# EasyEDA Pro project ProPrj_AUCompetition.epro, board 主控
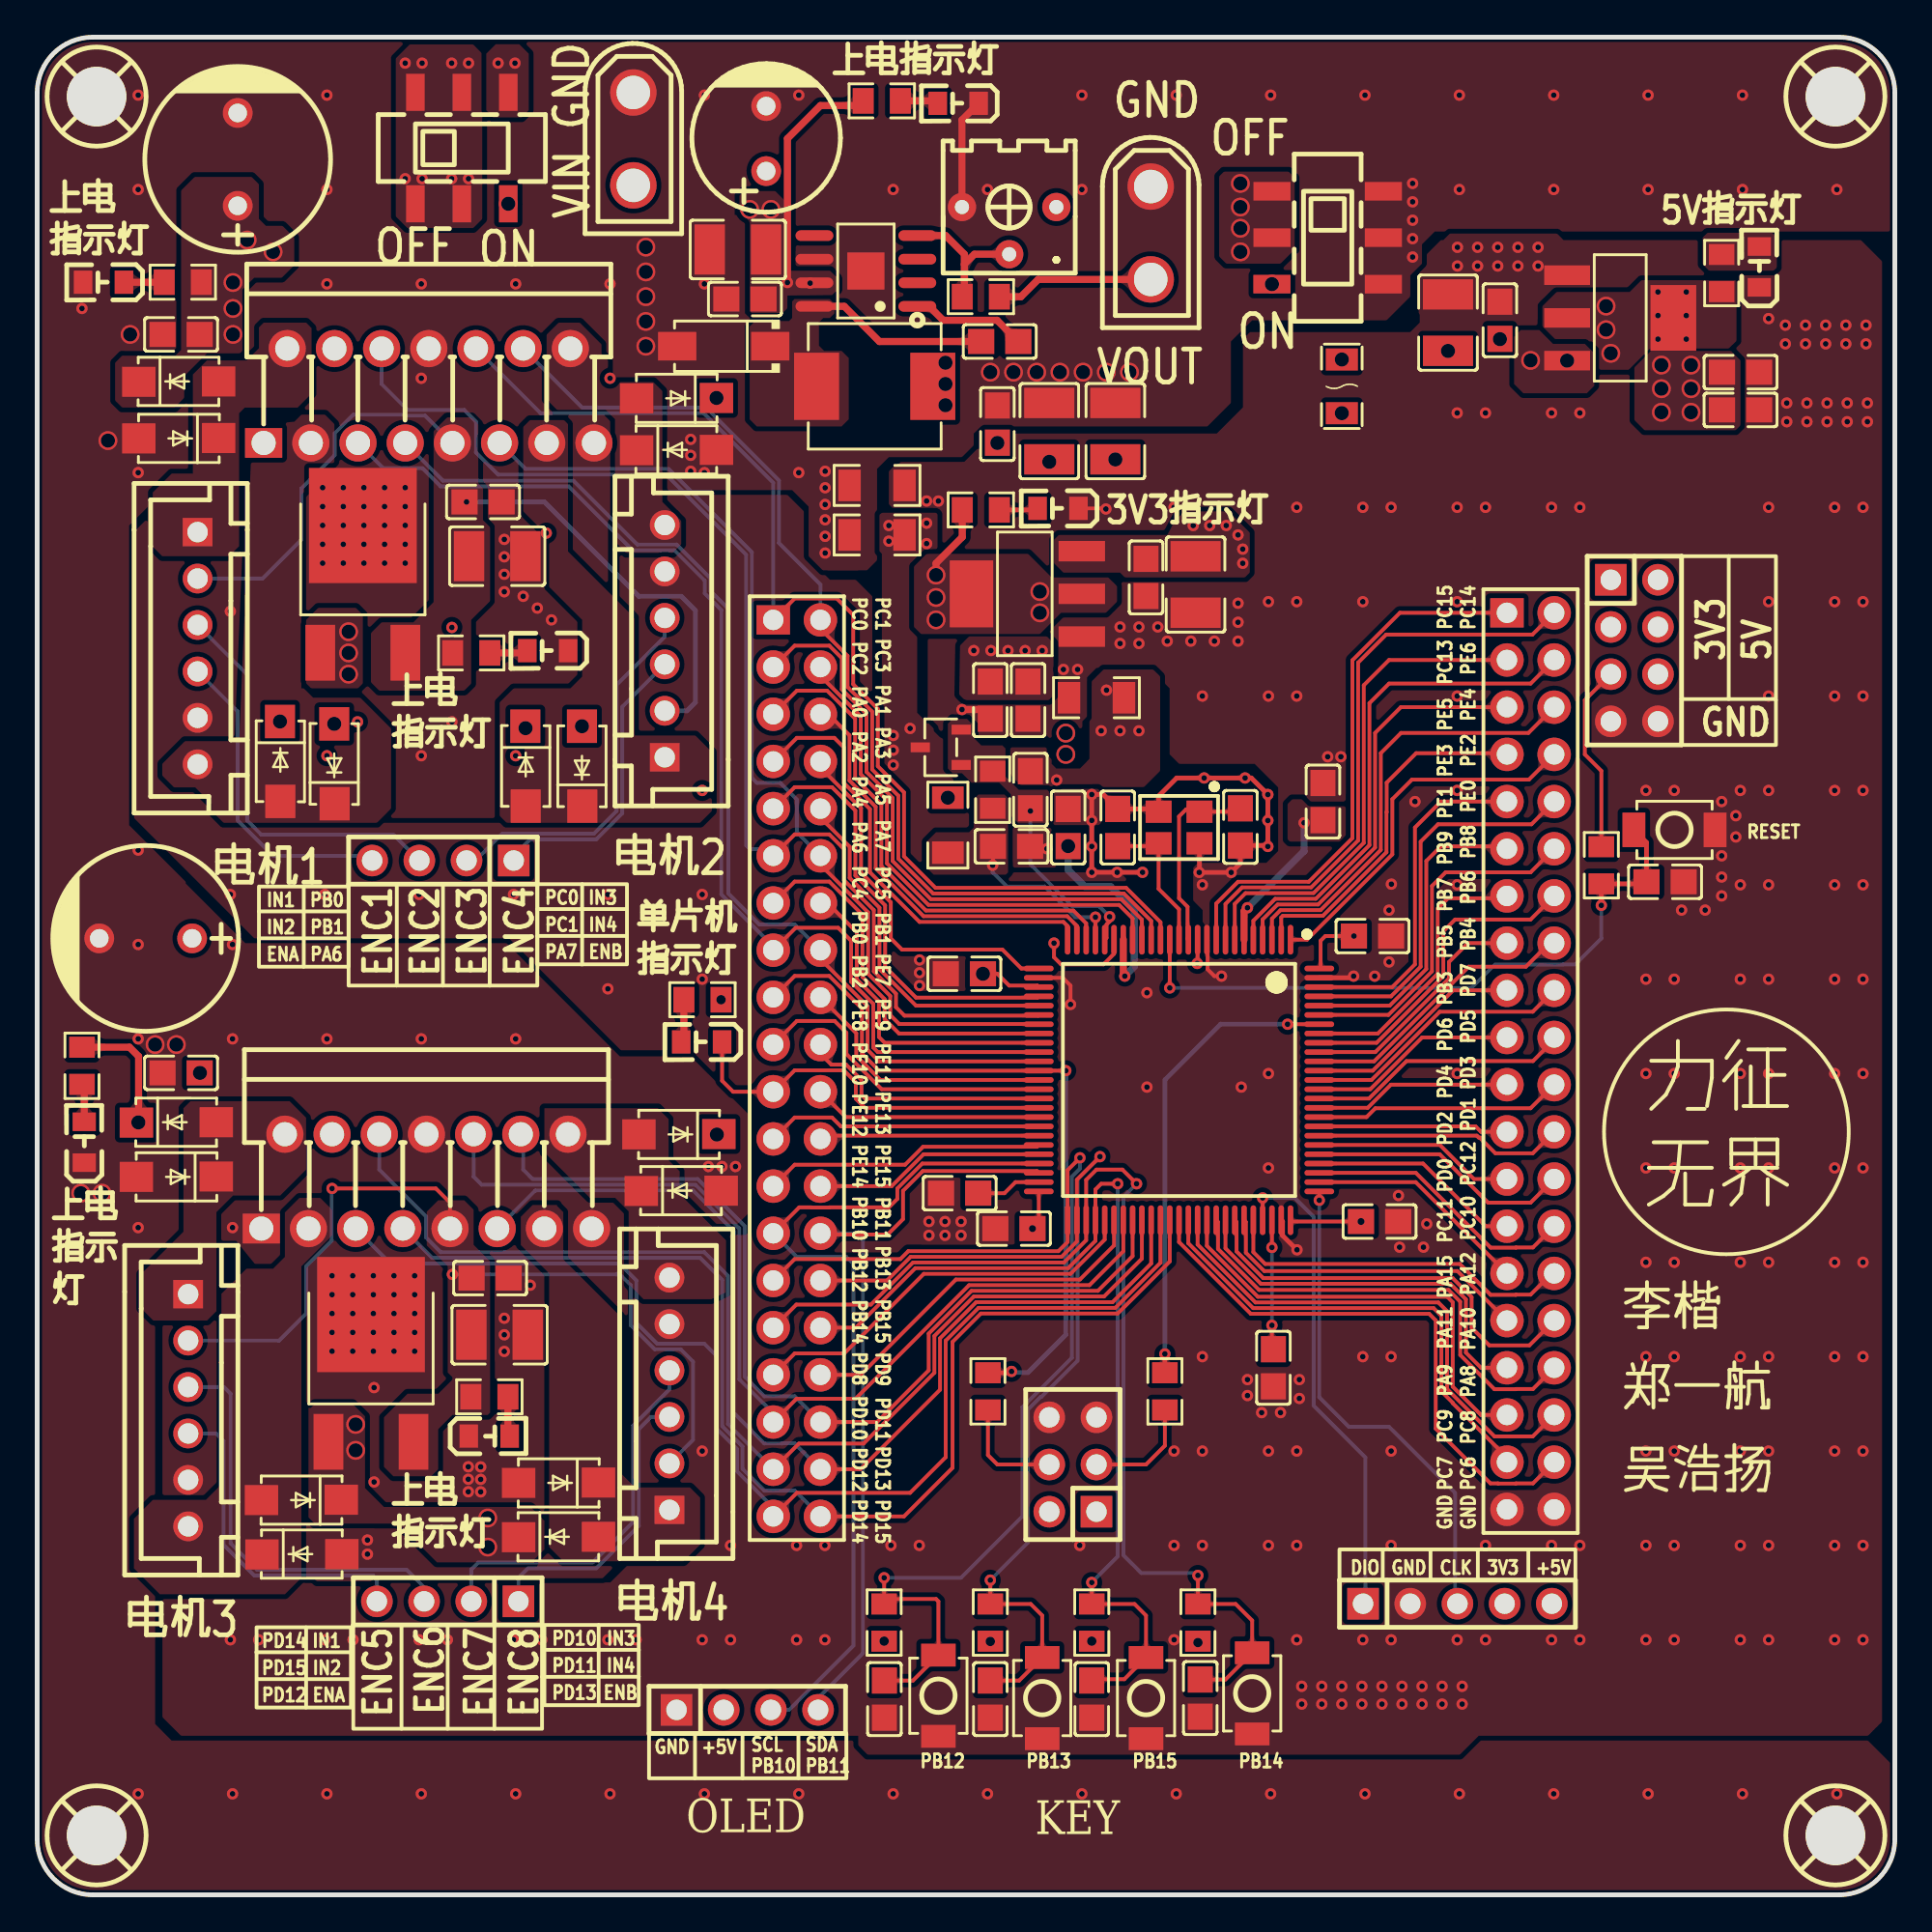
[diagram p7: board, top side]
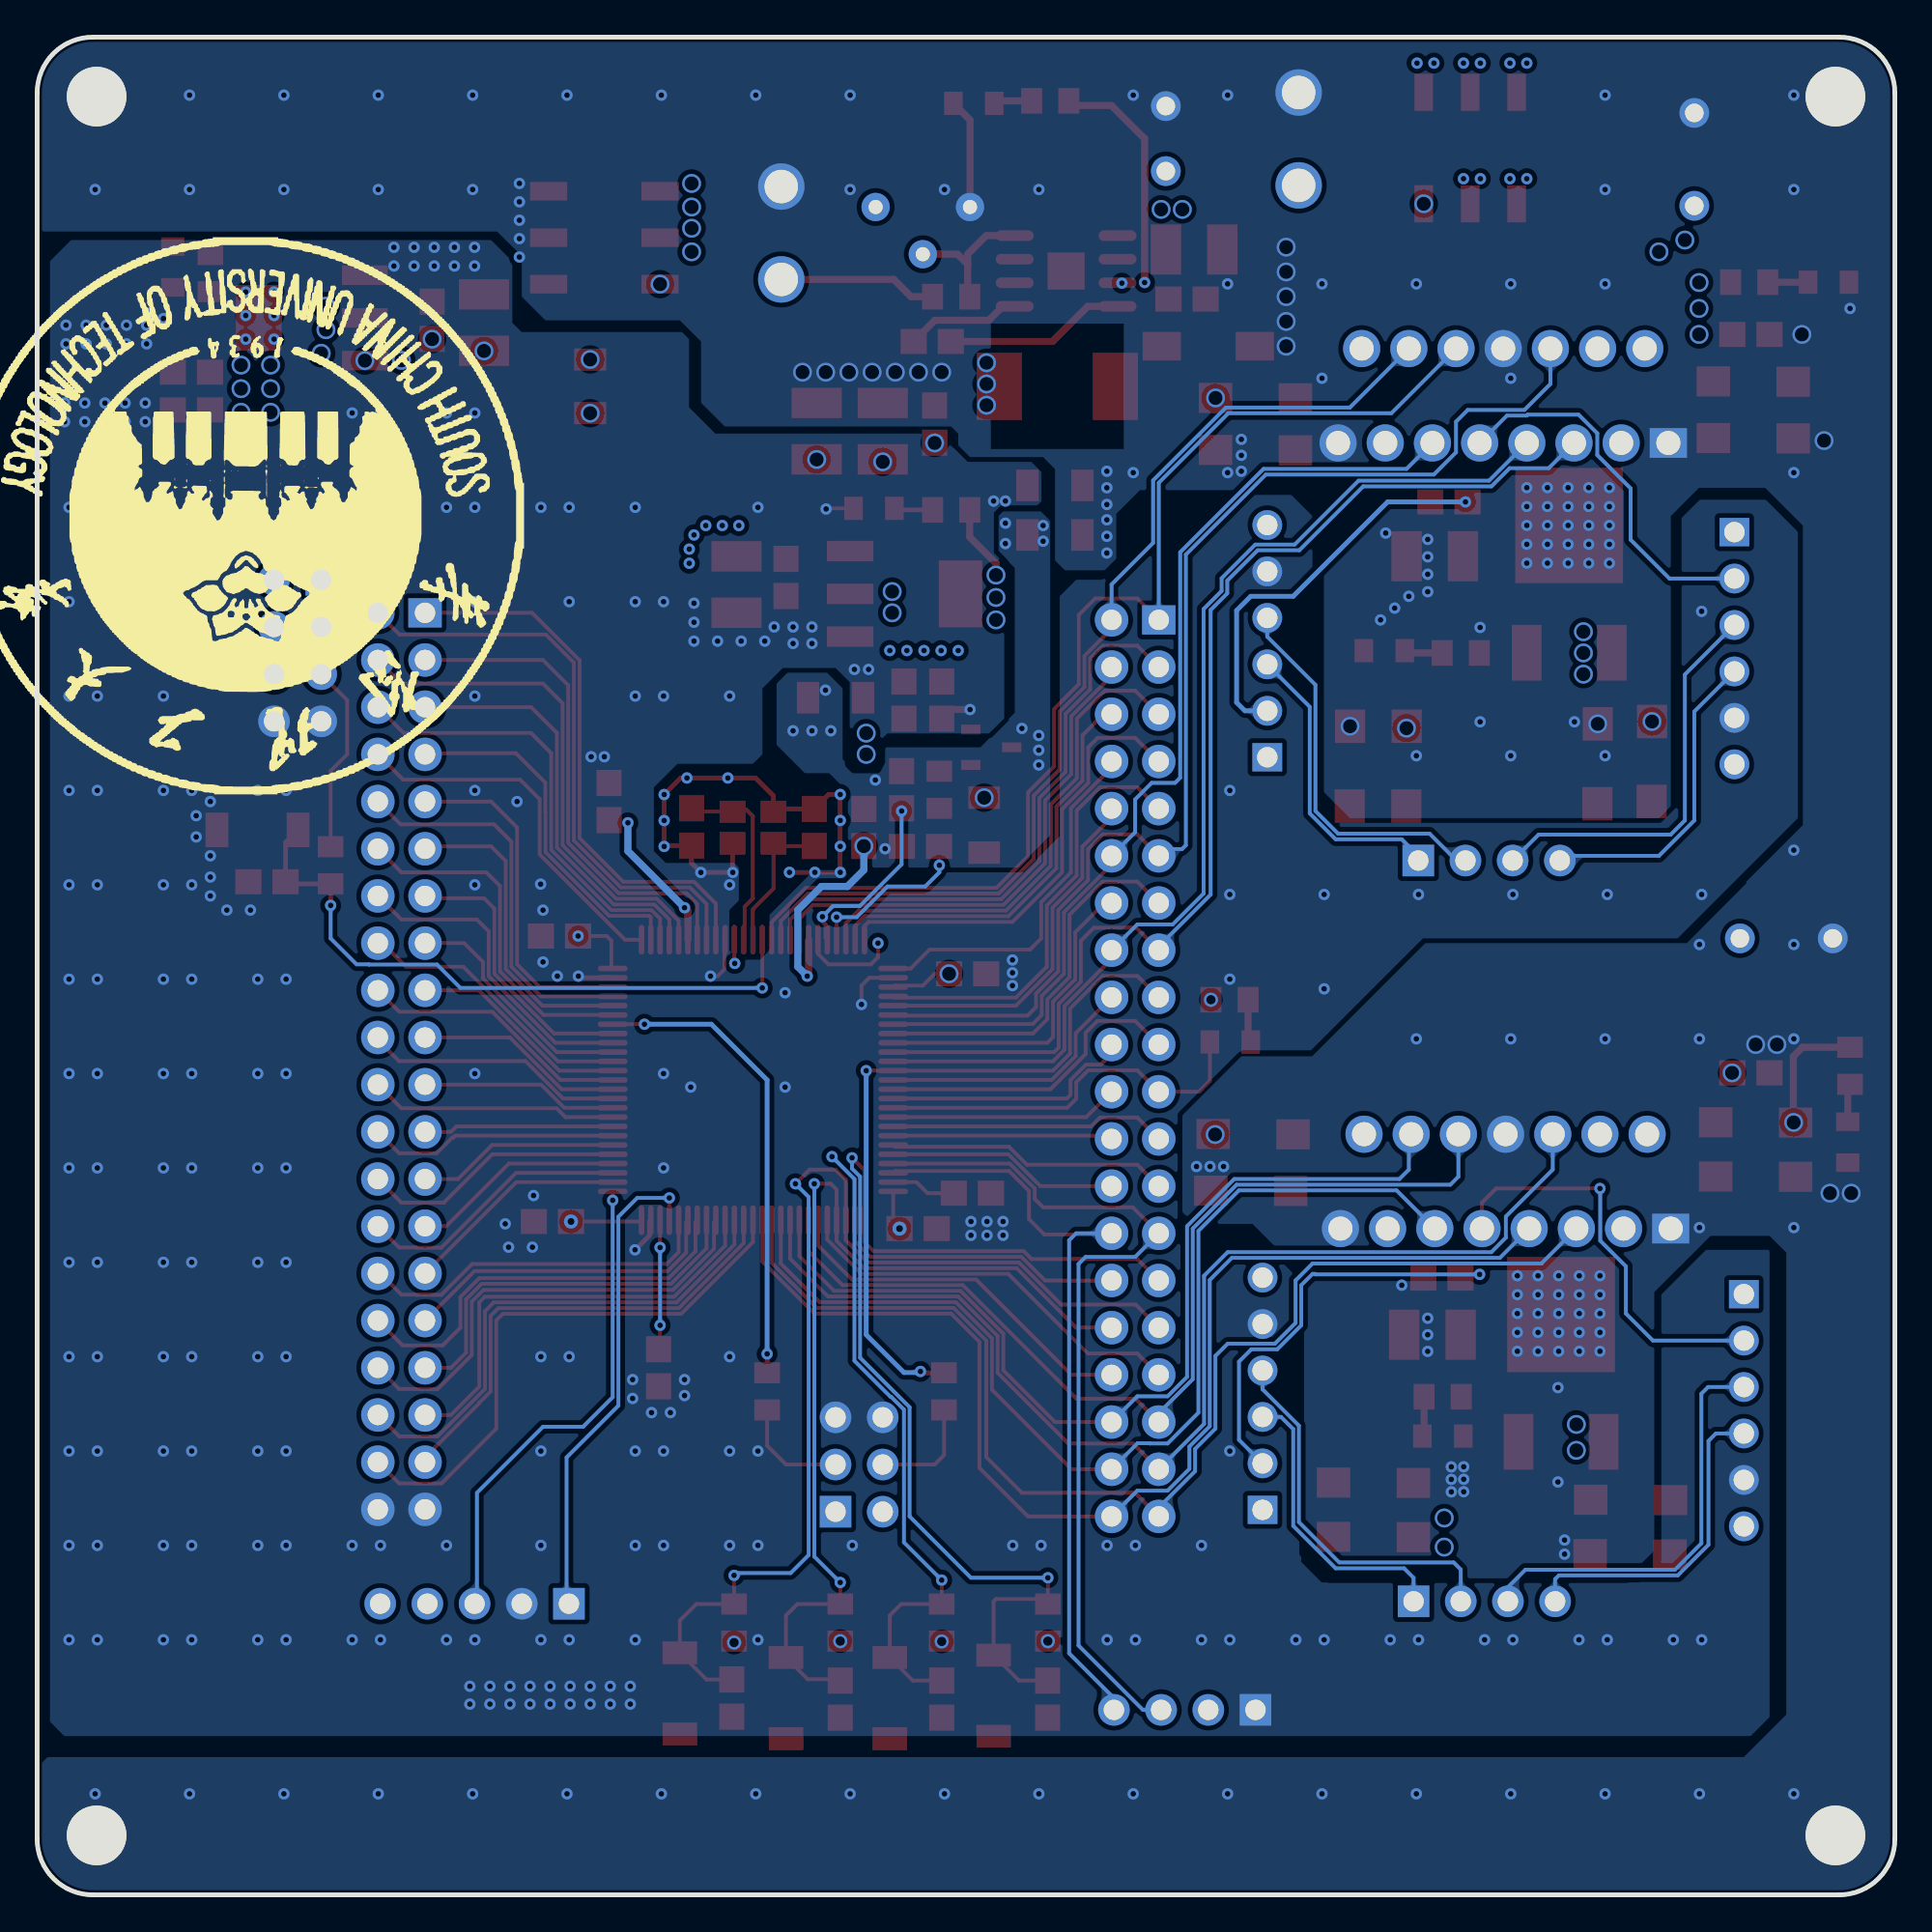
[diagram p8: board, bottom side, seen from below]

Outline 100 x 100 mm; copper layers: Top Layer, GND, POWER, Bottom Layer. Coordinates in mm from the lower left corner of the outline.
Outline path: 0,97 0,3 arc(0.88,0.88) 3,0 97,0 arc(99.12,0.88) 100,3 100,97 arc(99.12,99.12) 97,100 3,100 arc(0.88,99.12) 0,97
Stack: Top Layer 0.035mm Outer layer thickness 1oz / Dielectric1 0.2104mm 7628 RC49% 8.6mil / GND 0.0152mm Inner layer thickness / Dielectric2 1.065mm 1.1mm H/HOZ Copper / POWER 0.0152mm Inner layer thickness / Dielectric3 0.2104mm 7628 RC49% 8.6mil / Bottom Layer 0.035mm Outer layer thickness 1oz

## Design rules (mm)
spacing copperThickness1oz (default): track to track 0.102, other pairs 0.152 to 0.3
spacing copperThickness2oz: track to track 0.203, other pairs 0.152 to 0.3
track width copperThickness1oz (default): min 0.127, default 0.203, max 2.54
track width copperThickness2oz: min 0.203, default 0.254, max 2.54
differential pair differentialPair (default): width min 0.127, default 0.203, max 2.54; gap min 0.152, default 0.152
net DGND uses copperRegion
net PGND uses copperRegion
net VIN uses copperRegion
net VOUT uses copperRegion
net DCDC_OUT uses copperRegion
net VCC+3.3V uses copperRegion
net VCC+5V uses copperRegion
net AGND uses copperRegion
net $2N98 uses copperRegion
net OUT1 uses copperRegion
net OUT2 uses copperRegion
net OUT3 uses copperRegion
net OUT4 uses copperRegion
net $1N28 uses copperRegion
net 1LOG+5V uses copperRegion
net MVIN uses copperRegion

## Placement (name value [footprint] x y rotation side)
C1  10nF  [C0805]  51.82 83.62 180 top
C2  47uF  [CAP-TH_BD8.0-P3.50-D0.6-FD]  39.24 94.54 90 top
C3  100nF  [C0805]  38.1 85.9 180 top
C5  22uF  [C1210]  37.72 88.57 180 top
C6  22uF  [C1210]  58.04 78.79 270 top
C7  100nF  [C0805]  51.69 79.17 90 top
C8  100nF  [C0805]  59.69 70.92 270 top
C9  22uF  [C1210]  62.36 70.54 90 top
C10  100nF  [C0805]  51.31 64.31 270 top
C11  100nF  [C0805]  53.34 64.31 270 top
C12  22uF  [C1210]  75.95 84.63 270 top
C13  100nF  [C0805]  78.74 84.76 90 top
C14  100nF  [C0805]  91.69 81.97 0 top
C15  100nF  [C0805]  91.69 79.93 0 top
C16  100nF  [C0805]  52.45 56.44 0 top
C17  100nF  [C0805]  55.5 57.45 90 top
C18  100nF  [C0805]  69.22 58.85 90 top
C19  100nF  [C0805]  72.26 36.25 0 top
C20  100nF  [C0805]  71.88 51.61 0 top
C21  100nF  [C0805]  49.91 49.58 180 top
C22  100nF  [C0805]  52.58 35.86 180 top
C24  10uF  [C0805]  53.47 59.49 270 top
C25  20pF  [C0805]  64.77 57.49 270 top
C26  20pF  [C0805]  58.17 57.45 270 top
C27  100nF  [C0805]  87.63 54.53 0 top
C28  100nF  [C0805]  45.61 10.54 270 top
C29  22uF  [C1210]  24.89 30.15 180 top
C30  22uF  [C1210]  24.77 72.06 180 top
C33  22uF  [C1210]  54.48 78.79 270 top
C34  2.2uF  [C0805]  66.55 28.37 90 top
C35  2.2uF  [C0805]  49.66 37.77 0 top
C36  100nF  [C0805]  7.75 84 180 top
C38  100nF  [C0805]  24 74.98 0 top
C39  470uF  [CAP-TH_BD10.0-P5.00-D0.6-FD-A]  5.84 51.49 180 top
C40  100nF  [C0805]  7.75 44.25 180 top
C42  100nF  [C0805]  24.38 33.2 0 top
C43  470uF  [CAP-TH_BD10.0-P5.00-D0.6-FD-A]  10.8 93.42 90 top
C44  100nF  [C0805]  51.31 10.54 270 top
C45  100nF  [C0805]  62.61 10.59 270 top
C46  100nF  [C0805]  56.77 10.54 270 top
CN1  XT30UPB-M  [CONN-TH_XT30UPB-M]  32.09 94.52 270 top
CN2  XT30UPB-M  [CONN-TH_XT30UPB-M]  59.94 89.46 270 top
D2  SS34  [SMA_L4.3-W2.6-LS5.0-FD]  7.62 81.46 180 top
D3  SS34  [SMA_L4.3-W2.6-LS5.0-FD]  13.08 61.01 90 top
D4  SS34  [SMA_L4.3-W2.6-LS5.0-FD]  26.29 60.76 90 top
D5  SS34  [SMA_L4.3-W2.6-LS5.0-FD]  34.42 80.57 0 top
D6  SS34  [SMA_L4.3-W2.6-LS5.0-FD]  7.62 78.41 0 top
D7  SS34  [SMA_L4.3-W2.6-LS5.0-FD]  16 60.88 270 top
D8  SS34  [SMA_L4.3-W2.6-LS5.0-FD]  29.34 60.76 270 top
D9  SS34  [SMA_L4.3-W2.6-LS5.0-FD]  34.42 77.78 180 top
D10  SS34  [SMA_L4.3-W2.6-LS5.0-FD]  7.49 41.58 180 top
D11  SS34  [SMA_L4.3-W2.6-LS5.0-FD]  14.22 21.26 0 top
D12  SS34  [SMA_L4.3-W2.6-LS5.0-FD]  28.07 19.26 180 top
D13  SS34  [SMA_L4.3-W2.6-LS5.0-FD]  34.54 40.94 0 top
D14  SS34  [SMA_L4.3-W2.6-LS5.0-FD]  7.49 38.66 0 top
D15  SS34  [SMA_L4.3-W2.6-LS5.0-FD]  14.25 18.33 180 top
D16  SS34  [SMA_L4.3-W2.6-LS5.0-FD]  28.07 22.19 0 top
D17  SS34  [SMA_L4.3-W2.6-LS5.0-FD]  34.67 37.9 180 top
D18  SS54  [SMA_L4.4-W2.8-LS5.4-R-RD]  36.96 83.36 180 top
H1  PZ254V-11-05P  [HDR-TH_5P-P2.54-V-M]  76.45 15.67 0 top
H2  2.54-1*4P母  [HDR-TH_4P-P2.54-V-F]  38.23 9.96 0 top
H3  PZ254V-11-04P  [HDR-TH_4P-P2.54-V-M]  22.1 15.8 180 top
H4  PZ254V-11-04P  [HDR-TH_4P-P2.54-V-M]  21.84 55.68 180 top
KEY1  TS-1088R-02026  [SW-SMD_L3.9-W3.0-P4.45]  48.51 10.72 270 top
KEY2  TS-1088R-02026  [SW-SMD_L3.9-W3.0-P4.45]  54.1 10.59 270 top
KEY3  TS-1088R-02026  [SW-SMD_L3.9-W3.0-P4.45]  65.41 10.85 270 top
KEY4  TS-1088R-02026  [SW-SMD_L3.9-W3.0-P4.45]  59.69 10.59 270 top
L1  15uH  [IND-SMD_L7.0-W6.6_FXL0630]  45.09 81.2 180 top
LED1  -  [LED_0805]  49.53 96.44 180 top
LED2  -  [LED_0805]  92.71 87.68 90 top
LED3  -  [LED_0805]  54.9 74.64 180 top
LED4  -  [LED_0805]  35.72 45.92 180 top
LED5  -  [LED_0805]  3.52 86.81 180 top
LED6  -  [LED_0805]  27.43 66.98 180 top
LED7  -  [LED_0805]  24.38 24.69 0 top
LED8  -  [LED_0805]  2.54 40.56 90 top
R1  10kΩ  [R0805]  45.47 96.57 180 top
R2  3kΩ  [R0805]  90.68 87.3 270 top
R3  1kΩ  [R0805]  50.8 74.55 180 top
R4  0Ω  [R1206]  49.02 57.58 270 top
R5  0Ω  [R1206]  57.02 64.44 0 top
R6  1kΩ  [R0805]  51.44 59.49 270 top
R7  10kΩ  [R0805]  84.2 55.42 90 top
R8  10kΩ  [R0805]  60.71 27.1 90 top
R9  10kΩ  [R0805]  51.18 27.1 270 top
R10  1kΩ  [R0805]  35.81 48.18 0 top
R11  3kΩ  [R0805]  45.59 14.66 270 top
R12  10kΩ  [R0805]  7.84 86.81 180 top
R13  10kΩ  [R0805]  2.41 44.63 270 top
R14  3kΩ  [R0805]  23.37 66.85 180 top
R15  0Ω  [R1206]  45.21 75.87 180 top
R16  0Ω  [R1206]  45.21 73.2 180 top
R17  3kΩ  [R0805]  51.31 14.66 270 top
R18  3kΩ  [R0805]  62.48 14.66 270 top
R19  3kΩ  [R0805]  56.77 14.66 270 top
R20  10kΩ  [R0805]  50.8 86.03 0 top
R21  10kΩ  [RES-ADJ-TH_3362P]  52.32 89.59 180 top
R22  3kΩ  [R0805]  24.34 26.81 180 top
RESET  TS-1088R-02026  [SW-SMD_L3.9-W3.0-P4.45]  88.14 57.33 0 top
SCREW1  -  [M3螺丝]  96.8 96.8 0 top
SCREW2  -  [M3螺丝]  3.2 96.8 0 top
SCREW3  -  [M3螺丝]  3.2 3.2 0 top
SCREW4  -  [M3螺丝]  96.8 3.2 0 top
U1  TPS5430DDAR  [SOIC-8_L5.0-W4.0-P1.27-LS6.0-BL-EP2.0]  44.61 87.41 90 top
U2  AMS1117-3.3  [SOT-223-3_L6.5-W3.4-P2.30-LS7.0-BR]  53.26 70.03 0 top
U3  AMS1117-5.0  [SOT-223_L6.5-W3.5-P2.30-LS7.0-BR]  85.22 84.89 180 top
U4  STM32F407VET6  [LQFP-100_L14.0-W14.0-P0.50-LS16.0-BL]  61.47 43.87 180 top
U5  TL431ACDBZR  [SOT-23-3_L3.0-W1.7-P0.95-LS2.9-BR]  48.64 61.77 0 top
U6  DS1021-2x3SF11-B  [HDR-TH_6P-P2.54-V-M-R2-C3-S2.54]  55.75 23.16 90 top
U7  2541WV-2x20P  [HDR-TH_40P-P2.54-V-M-R2-C20-S2.54]  80.39 44.88 270 top
U8  2541WV-2x20P  [HDR-TH_40P-P2.54-V-M-R2-C20-S2.54]  40.89 44.5 270 top
U9  PJ7805TE  [TO-252-2_L6.6-W6.1-P4.57-LS9.9-BR-CW]  17.53 70.29 270 top
U10  L298N  [MULTIWATT-15_L19.6-W5.0-P1.27-L]  21.08 80.7 0 top
U11  ZX-XH2.54-6PZZ  [CONN-TH_6P-P2.50_ZX-XH2.54-6PZZ]  8.64 67.11 90 top
U12  ZX-XH2.54-6PZZ  [CONN-TH_6P-P2.50_ZX-XH2.54-6PZZ]  33.78 67.49 270 top
U13  ZX-XH2.54-6PZZ  [CONN-TH_6P-P2.50_ZX-XH2.54-6PZZ]  8.13 26.09 90 top
U14  ZX-XH2.54-6PZZ  [CONN-TH_6P-P2.50_ZX-XH2.54-6PZZ]  34.04 26.97 270 top
U15  L298N  [MULTIWATT-15_L19.6-W5.0-P1.27-L]  20.95 38.41 0 top
U16  YSSP2AG00  [SW-SMD_YSSP2AG00]  69.47 89.2 270 top
U17  HX PZ2.54-2x4P ZZ  [HDR-TH_8P-P2.54-V-M-R2-C4-S2.54]  85.98 66.98 270 top
U18  JK-nSMD005/60V  [F1206]  70.23 81.2 270 top
U19  PJ7805TE  [TO-252-2_L6.6-W6.1-P4.57-LS9.9-BR-CW]  17.97 27.81 270 top
U20  YSSP2AG00  [SW-SMD_YSSP2AG00]  22.86 94.03 0 top
X1  8MHz  [CRYSTAL-SMD_4P-L3.2-W2.5-BL_SIT8008BI]  61.47 57.45 180 top

## Footprints (pads in the part's own frame, mm; a bottom-side part is the same pattern mirrored in y, then rotated)
C0805
  rect 1.41x1.35 smd: 1(-1,0) 2(1,0)
C1210
  rect 1.635x2.7 smd: 1(-1.518,0) 2(1.518,0)
CAP-TH_BD8.0-P3.50-D0.6-FD
  round 1.6 hole 1: 1(-1.75,0) 2(1.75,0)
CAP-TH_BD10.0-P5.00-D0.6-FD-A
  round 1.6 hole 1: 1(-2.5,0) 2(2.5,0)
CONN-TH_6P-P2.50_ZX-XH2.54-6PZZ
  rect 1.524x1.6 hole 1.1: 1(6.25,0)
  round 1.6 hole 1.1: 2(3.75,0) 3(1.25,0) 4(-1.25,0) 5(-3.75,0) 6(-6.25,0)
CONN-TH_XT30UPB-M
  round 2.499 hole 1.801: 1(-2.499,0) 2(2.499,0)
CRYSTAL-SMD_4P-L3.2-W2.5-BL_SIT8008BI
  rect 1.4x1.2 smd: 1(-1.1,-0.85) 2(1.1,-0.85) 3(1.1,0.85) 4(-1.1,0.85)
F1206
  rect 1.19x1.728 smd: 1(-1.445,0) 2(1.445,0)
HDR-TH_4P-P2.54-V-F
  rect 1.7x1.7 hole 1.1: 1(-3.81,0)
  round 1.7 hole 1.1: 2(-1.27,0) 3(1.27,0) 4(3.81,0)
HDR-TH_4P-P2.54-V-M
  rect 1.7x1.7 hole 1.1: 1(-3.81,0)
  round 1.7 hole 1.1: 2(-1.27,0) 3(1.27,0) 4(3.81,0)
HDR-TH_5P-P2.54-V-M
  rect 1.7x1.7 hole 1.1: 1(-5.08,0)
  round 1.7 hole 1.1: 2(-2.54,0) 3(0,0) 4(2.54,0) 5(5.08,0)
HDR-TH_6P-P2.54-V-M-R2-C3-S2.54
  rect 1.7x1.7 hole 1.1: 1(-2.54,-1.27)
  round 1.7 hole 1.1: 2(-2.54,1.27) 3(0,-1.27) 4(0,1.27) 5(2.54,-1.27) 6(2.54,1.27)
HDR-TH_8P-P2.54-V-M-R2-C4-S2.54
  rect 1.7x1.7 hole 1.1: 1(-3.81,-1.27)
  round 1.7 hole 1.1: 2(-3.81,1.27) 3(-1.27,-1.27) 4(-1.27,1.27) 5(1.27,-1.27) 6(1.27,1.27) 7(3.81,-1.27) 8(3.81,1.27)
HDR-TH_40P-P2.54-V-M-R2-C20-S2.54
  rect 1.575x1.8 hole 1.1: 1(-24.13,-1.27)
  round 1.8 hole 1.1: 2(-24.13,1.27) 3(-21.59,-1.27) 4(-21.59,1.27) 5(-19.05,-1.27) 6(-19.05,1.27) 7(-16.51,-1.27) 8(-16.51,1.27) 9(-13.97,-1.27) 10(-13.97,1.27) 11(-11.43,-1.27) 12(-11.43,1.27) 13(-8.89,-1.27) 14(-8.89,1.27) 15(-6.35,-1.27) 16(-6.35,1.27) 17(-3.81,-1.27) 18(-3.81,1.27) 19(-1.27,-1.27) 20(-1.27,1.27) 21(1.27,-1.27) 22(1.27,1.27) 23(3.81,-1.27) 24(3.81,1.27) 25(6.35,-1.27) 26(6.35,1.27) 27(8.89,-1.27) 28(8.89,1.27) 29(11.43,-1.27) 30(11.43,1.27) 31(13.97,-1.27) 32(13.97,1.27) 33(16.51,-1.27) 34(16.51,1.27) 35(19.05,-1.27) 36(19.05,1.27) 37(21.59,-1.27) 38(21.59,1.27) 39(24.13,-1.27) 40(24.13,1.27)
IND-SMD_L7.0-W6.6_FXL0630
  rect 2.424x3.62 smd: 1(3.128,0) 2(-3.128,0)
LED_0805
  rect 1x1.25 smd: 1(-1.15,0.005) 2(1.05,0.005)
LQFP-100_L14.0-W14.0-P0.50-LS16.0-BL
  oval 0.3x1.6 smd: 1(-6,-7.55) 2(-5.5,-7.55) 3(-5,-7.55) 4(-4.5,-7.55) 5(-4,-7.55) 6(-3.5,-7.55) 7(-3,-7.55) 8(-2.5,-7.55) 9(-2,-7.55) 10(-1.5,-7.55) 11(-1,-7.55) 12(-0.5,-7.55) 13(0,-7.55) 14(0.5,-7.55) 15(1,-7.55) 16(1.5,-7.55) 17(2,-7.55) 18(2.5,-7.55) 19(3,-7.55) 20(3.5,-7.55) 21(4,-7.55) 22(4.5,-7.55) 23(5,-7.55) 24(5.5,-7.55) 25(6,-7.55) 51(6,7.55) 52(5.5,7.55) 53(5,7.55) 54(4.5,7.55) 55(4,7.55) 56(3.5,7.55) 57(3,7.55) 58(2.5,7.55) 59(2,7.55) 60(1.5,7.55) 61(1,7.55) 62(0.5,7.55) 63(0,7.55) 64(-0.5,7.55) 65(-1,7.55) 66(-1.5,7.55) 67(-2,7.55) 68(-2.5,7.55) 69(-3,7.55) 70(-3.5,7.55) 71(-4,7.55) 72(-4.5,7.55) 73(-5,7.55) 74(-5.5,7.55) 75(-6,7.55)
  oval 1.6x0.3 smd: 26(7.55,-6) 27(7.55,-5.5) 28(7.55,-5) 29(7.55,-4.5) 30(7.55,-4) 31(7.55,-3.5) 32(7.55,-3) 33(7.55,-2.5) 34(7.55,-2) 35(7.55,-1.5) 36(7.55,-1) 37(7.55,-0.5) 38(7.55,0) 39(7.55,0.5) 40(7.55,1) 41(7.55,1.5) 42(7.55,2) 43(7.55,2.5) 44(7.55,3) 45(7.55,3.5) 46(7.55,4) 47(7.55,4.5) 48(7.55,5) 49(7.55,5.5) 50(7.55,6) 76(-7.55,6) 77(-7.55,5.5) 78(-7.55,5) 79(-7.55,4.5) 80(-7.55,4) 81(-7.55,3.5) 82(-7.55,3) 83(-7.55,2.5) 84(-7.55,2) 85(-7.55,1.5) 86(-7.55,1) 87(-7.55,0.5) 88(-7.55,0) 89(-7.55,-0.5) 90(-7.55,-1) 91(-7.55,-1.5) 92(-7.55,-2) 93(-7.55,-2.5) 94(-7.55,-3) 95(-7.55,-3.5) 96(-7.55,-4) 97(-7.55,-4.5) 98(-7.55,-5) 99(-7.55,-5.5) 100(-7.55,-6)
M3螺丝
  round 3.2 hole 3.2: 1(0,0)
MULTIWATT-15_L19.6-W5.0-P1.27-L
  rect 2x1.6 hole 1.3: 1(-8.89,-2.54)
  round 2 hole 1.3: 2(-7.62,2.54) 3(-6.35,-2.54) 4(-5.08,2.54) 5(-3.81,-2.54) 6(-2.54,2.54) 7(-1.27,-2.54) 8(0,2.54) 9(1.27,-2.54) 10(2.54,2.54) 11(3.81,-2.54) 12(5.08,2.54) 13(6.35,-2.54) 14(7.62,2.54) 15(8.89,-2.54)
R0805
  rect 1.133x1.377 smd: 1(-1,0) 2(1,0)
R1206
  rect 1.208x1.701 smd: 1(-1.479,0) 2(1.479,0)
RES-ADJ-TH_3362P
  round 1.524 hole 0.762: 1(-2.54,-1.27) 2(0,1.27) 3(2.54,-1.27)
SMA_L4.3-W2.6-LS5.0-FD
  rect 1.8x1.62 smd: 1(-2.15,-0.009) 2(2.15,0.009)
SMA_L4.4-W2.8-LS5.4-R-RD
  rect 2.062x1.539 smd: 1(2.503,0) 2(-2.503,0)
SOIC-8_L5.0-W4.0-P1.27-LS6.0-BL-EP2.0
  oval 0.574x2.037 smd: 1(-1.905,-2.768) 2(-0.635,-2.768) 3(0.635,-2.768) 4(1.905,-2.768) 5(1.905,2.768) 6(0.635,2.768) 7(-0.635,2.768) 8(-1.905,2.768)
  rect 1.999x1.999 smd: 9(0,0)
SOT-23-3_L3.0-W1.7-P0.95-LS2.9-BR
  rect 1.038x0.532 smd: 1(1.101,-0.95) 2(1.101,0.95) 3(-1.101,0)
SOT-223-3_L6.5-W3.4-P2.30-LS7.0-BR
  rect 2.5x1.1 smd: 1(2.97,-2.3) 2(2.97,0) 3(2.97,2.3)
  rect 2.34x3.6 smd: 4(-2.97,0)
SOT-223_L6.5-W3.5-P2.30-LS7.0-BR
  rect 2.465x1.05 smd: 1(2.857,-2.3) 2(2.857,0) 3(2.857,2.3)
  rect 2.465x3.54 smd: 4(-2.857,0)
SW-SMD_L3.9-W3.0-P4.45
  rect 1.23x1.86 smd: 1(-2.185,0) 2(2.185,0)
SW-SMD_YSSP2AG00
  rect 1x2 smd: 1(-2.5,3) 2(0,3) 3(2.5,3) 4(-2.5,-3) 5(0,-3) 6(2.5,-3)
TO-252-2_L6.6-W6.1-P4.57-LS9.9-BR-CW
  rect 3x1.6 smd: 1(3.424,-2.29) 3(3.424,2.29)
  rect 6.2x5.8 smd: 2(-3.424,0)

## Nets
As in the schematic, except:
PGND: C2.2 C3.2 C5.2 C6.1 C7.2 C29.1 C30.1 C33.1 C36.2 C38.2 C39.2 C40.2 C42.2 C43.2 CN1.1 CN2.1 D6.1 D7.1 D8.1 D9.1 D14.1 D15.1 D16.1 D17.1 D18.1 LED1.1 LED5.2 LED6.1 LED7.1 LED8.1 R15.2 R16.2 R21.3 SCREW1.1 SCREW2.1 SCREW3.1 SCREW4.1 U1.6 U1.9 U9.2 U10.1 U10.8 U10.15 U15.1 U15.8 U15.15 U16.1 U16.2 U16.3 U19.2
$3N201: LED5.1 R12.2

Pads without a net: R21 1; U1 2 3 5

## Via types
v1: diameter 0.61, hole 0.305, Top Layer to Bottom Layer, 499 vias
v2: diameter 1.016, hole 0.762, Top Layer to Bottom Layer, 77 vias
v3: diameter 0.762, hole 0.508, Top Layer to Bottom Layer, 5 vias
v4: diameter 0.762, hole 0.381, Top Layer to Bottom Layer, 2 vias

## Routing (per net, layer and track width the routed paths; a pad name or vN(x,y) marks a point on that pad's centre or on a via; arc(x,y) is an arc through that point)
AGND: length 11.5
  Top Layer w0.203: v1(54.36,56.31) 54.23,56.44 C16.2 ; U4.20 57.97,50.65 57.4,50.09 55.12,50.09 54.74,50.47 v1(54.74,51.23)
  GND w0.203: v1(54.36,56.31) 54.61,56.31 54.74,56.19 v1(54.74,51.23)
  vias: v1(45.85,73.71) v1(45.85,72.87) v1(46.08,62.41) v1(46.08,61.62) v1(46.08,60.82) v1(46.99,62.79) v1(47.88,73.84) v1(47.88,72.74) v1(54.88,60.01) v1(57.28,62.66) v1(57.56,64.85) v1(58.29,62.66) v1(59.31,62.66)
DGND: length 40.1
  Top Layer w0.203: U4.27 55.21,49.37 55.63,48.95 v1(55.63,47.93) ; U4.10 63.01,51.38 63.01,49.82 63.37,49.45 v1(63.75,49.45) ; v1(57.53,74.6) 57.5,74.63 LED3.1
  Top Layer w0.254: U4.99 70.78,49.37 v1(70.87,49.45) ; v1(67.82,34.72) 67.81,34.72 67.04,35.49 67.04,36.25 U4.74 ; v1(59.5,55.04) v1(58.14,55.04) v1(56.77,55.04) v1(56.77,56.44) v1(56.77,57.84) v1(56.77,59.23) 57.39,59.23 C26.1 60.22,58.45 X1.2 60.37,59.15 61.34,60.12 v1(62.82,60.12) v1(65.02,60.12) 65.36,60.12 v1(66.25,59.23) v1(66.25,57.83) v1(66.25,56.44) 66.2,56.49 C25.2 64.77,55.53 v1(64.27,55.04) v1(62.55,55.04) 62.57,55.05 X1.4
  Top Layer w0.381: C10.2 50.82,63.81 v1(49.78,63.81)
  vias: v1(10.4,69.09) v1(10.4,53.85) v1(10.4,13.73) v1(11.92,13.73) v1(15.48,53.85) v1(15.48,13.73) v1(17,13.73) v1(20.56,53.85) v1(20.56,13.73) v1(22.08,13.73) v1(25.64,53.85) v1(25.64,13.73) v1(27.16,13.73) v1(30.72,53.85) v1(30.72,48.77) v1(30.72,13.73) v1(32.24,13.73) v1(35.8,59.45) v1(35.8,53.85) v1(35.8,49.29) v1(35.8,23.89) v1(35.8,13.73) v1(37.32,18.81) v1(37.32,13.73) v1(40.88,18.81) v1(40.88,13.73) v1(42.4,18.81) v1(42.4,13.73) v1(45.96,18.81) v1(47.5,50.33) v1(47.5,49.64) v1(47.5,48.95) v1(47.48,18.81) v1(47.88,75.03) v1(48.01,36.25) v1(48.01,35.5) v1(48.51,75.03) v1(48.87,36.25) v1(48.87,35.5) v1(49.74,36.25) v1(49.74,35.5) v1(55.25,65.96) v1(56.01,65.96) v1(56.12,18.81) v1(58.29,68.25) v1(58.29,67.36) v1(59.31,68.25) v1(59.31,67.36) v1(59.74,48.56) v1(59.74,43.48) v1(60.32,68.25) v1(60.83,67.49) v1(61.2,74.69) v1(61.2,23.89) v1(61.2,18.81) v1(61.2,13.73) v1(62.1,67.49) v1(62.72,64.53) v1(62.72,54.37) v1(62.72,28.97) v1(62.72,23.89) v1(62.72,18.81) v1(63.37,67.49) v1(64.64,69.53) v1(64.64,68.5) v1(64.64,67.49) v1(64.82,43.48) v1(65.15,27.74) v1(65.15,26.88) v1(65.91,25.96) v1(66.28,69.61) v1(66.28,64.53) v1(66.28,44.21) v1(66.28,39.13) v1(66.28,23.89) v1(66.28,18.81) v1(66.93,25.96) v1(67.8,74.69) v1(67.8,69.61) v1(67.8,64.53) v1(67.8,23.89) v1(67.8,18.81) v1(67.8,13.73) v1(67.94,27.74) v1(67.94,26.72) v1(68.07,11.23) v1(68.07,10.27) v1(69.15,11.23) v1(69.15,10.27) v1(69.47,61.27) v1(70.18,61.27) v1(70.23,11.23) v1(70.23,10.27) v1(71.31,11.23) v1(71.31,10.27) v1(71.36,74.69) v1(71.36,69.61) v1(71.36,28.97) v1(71.36,13.73) v1(72,49.45) v1(72.39,11.23) v1(72.39,10.27) v1(72.77,53.01) v1(72.77,50.22) v1(72.88,74.69) v1(72.9,54.41) v1(72.88,28.97) v1(72.88,23.89) v1(72.88,18.81) v1(72.88,13.73) v1(73.28,37.64) v1(73.34,34.86) v1(73.47,11.23) v1(73.47,10.27) v1(74.17,58.85) v1(74.55,11.23) v1(74.55,10.27) v1(74.62,34.86) v1(74.8,36.12) v1(75.63,11.23) v1(75.63,10.27) v1(76.44,79.77) v1(76.44,74.69) v1(76.44,69.61) v1(76.44,64.53) v1(76.44,59.45) v1(76.44,54.37) v1(76.44,44.21) v1(76.44,13.73) v1(76.45,88.69) v1(76.45,87.68) v1(76.71,11.23) v1(76.71,10.27) v1(77.54,88.69) v1(77.54,87.68) v1(77.96,79.77) v1(77.96,74.69) v1(77.96,18.81) v1(77.96,13.73) v1(78.62,88.69) v1(78.62,87.68) v1(79.71,88.69) v1(79.71,87.68) v1(80.79,88.69) v1(80.79,87.68) v1(81.52,79.77) v1(81.52,74.69) v1(81.52,18.81) v1(81.52,13.73) v1(83.04,79.77) v1(83.04,74.69) v1(83.04,18.81) v1(83.04,13.73) v1(86.6,59.45) v1(86.6,49.29) v1(86.6,44.21) v1(86.6,39.13) v1(86.6,34.05) v1(86.6,28.97) v1(86.6,23.89) v1(86.6,18.81) v1(86.6,13.73) v1(88.12,59.45) v1(88.12,49.29) v1(88.12,44.21) v1(88.12,39.13) v1(88.12,34.05) v1(88.12,28.97) v1(88.12,23.89) v1(88.12,18.81) v1(88.12,13.73) v1(88.52,53.01) v1(89.79,53.01) v1(90.68,58.85) v1(90.68,55.93) v1(90.68,54.79) v1(90.68,53.77) v1(91.44,58.09) v1(91.44,56.95) v1(91.68,59.45) v1(91.68,54.37) v1(91.68,49.29) v1(91.68,44.21) v1(91.68,39.13) v1(91.68,34.05) v1(91.68,28.97) v1(91.68,23.89) v1(91.68,18.81) v1(91.68,13.73) v1(93.2,84.85) v1(93.2,74.69) v1(93.2,69.61) v1(93.2,64.53) v1(93.2,59.45) v1(93.2,54.37) v1(93.2,49.29) v1(93.2,44.21) v1(93.2,39.13) v1(93.2,34.05) v1(93.2,28.97) v1(93.2,23.89) v1(93.2,18.81) v1(93.2,13.73) v1(94.11,84.5) v1(94.11,83.49) v1(94.18,80.31) v1(94.18,79.3) v1(95.19,84.5) v1(95.19,83.49) v1(95.27,80.31) v1(95.27,79.3) v1(96.28,84.5) v1(96.28,83.49) v1(96.35,80.31) v1(96.35,79.3) v1(96.76,74.69) v1(96.76,69.61) v1(96.76,64.53) v1(96.76,59.45) v1(96.76,54.37) v1(96.76,49.29) v1(96.76,44.21) v1(96.76,39.13) v1(96.76,34.05) v1(96.76,28.97) v1(96.76,23.89) v1(96.76,18.81) v1(96.76,13.73) v1(97.36,84.5) v1(97.36,83.49) v1(97.44,80.31) v1(97.44,79.3) v1(98.28,74.69) v1(98.28,69.61) v1(98.28,64.53) v1(98.28,59.45) v1(98.28,54.37) v1(98.28,49.29) v1(98.28,44.21) v1(98.28,39.13) v1(98.28,34.05) v1(98.28,28.97) v1(98.28,23.89) v1(98.28,18.81) v1(98.28,13.73) v1(98.45,84.5) v1(98.45,83.49) v1(98.52,80.31) v1(98.52,79.3)
PGND: length 6
  Top Layer w0.381: LED1.1 49.78,95.54 R21.3
  vias: v1(2.41,85.39) v1(5.44,96.88) v1(5.44,91.8) v1(5.44,76.56) v1(5.44,56.24) v1(5.44,51.16) v1(5.44,46.08) v1(5.44,35.92) v1(5.44,5.44) v1(10.52,51.16) v1(10.52,46.08) v1(10.52,35.92) v1(10.52,5.44) v1(15.37,75.75) v1(15.37,74.73) v1(15.37,73.72) v1(15.37,72.7) v1(15.37,71.69) v1(15.6,96.88) v1(15.6,91.8) v1(15.6,86.72) v1(15.6,61.32) v1(15.6,46.08) v1(15.6,5.44) v1(15.88,33.33) v1(15.88,32.31) v1(15.88,31.29) v1(15.88,30.28) v1(15.88,29.26) v1(16.48,75.75) v1(16.48,74.73) v1(16.48,73.72) v1(16.48,72.7) v1(16.48,71.69) v1(16.99,33.33) v1(16.99,32.31) v1(16.99,31.29) v1(16.99,30.28) v1(16.99,29.26) v1(17.25,63.14) v1(17.59,75.75) v1(17.59,74.73) v1(17.59,73.72) v1(17.59,72.7) v1(17.59,71.69) v1(17.78,19.1) v1(17.78,18.34) v1(18.1,33.33) v1(18.1,32.31) v1(18.1,31.29) v1(18.1,30.28) v1(18.1,29.26) v1(18.14,27.31) v1(18.14,22.23) v1(18.7,75.75) v1(18.7,74.73) v1(18.7,73.72) v1(18.7,72.7) v1(18.7,71.69) v1(19.21,33.33) v1(19.21,32.31) v1(19.21,31.29) v1(19.21,30.28) v1(19.21,29.26) v1(19.81,75.75) v1(19.81,74.73) v1(19.81,73.72) v1(19.81,72.7) v1(19.81,71.69) v1(20.32,33.33) v1(20.32,32.31) v1(20.32,31.29) v1(20.32,30.28) v1(20.32,29.26) v1(20.68,86.72) v1(20.68,81.64) v1(20.68,61.32) v1(20.68,46.08) v1(20.68,5.44) v1(22.33,68.22) v1(22.33,63.14) v1(23.21,23.04) v1(23.21,22.37) v1(23.21,21.7) v1(23.88,23.04) v1(23.88,22.37) v1(23.88,21.69) v1(25.15,72.96) v1(25.15,72.03) v1(25.15,71.09) v1(25.15,70.15) v1(25.15,31.04) v1(25.15,30.15) v1(25.15,29.25) v1(25.76,86.72) v1(25.76,61.32) v1(25.76,46.08) v1(25.76,5.44) v1(26.16,69.9) v1(26.54,32.82) v1(26.92,69.27) v1(27.41,73.3) v1(27.69,68.63) v1(30.84,86.72) v1(30.84,81.64) v1(30.84,5.44) v1(35.18,78.35) v1(35.18,77.49) v1(35.18,76.63) v1(35.92,96.88) v1(35.92,86.72) v1(35.92,76.56) v1(35.92,5.44) v1(36.13,39.21) v1(36.86,39.21) v1(37.59,39.21) v1(41,96.88) v1(41,76.56) v1(41,5.44) v1(42.42,76.63) v1(42.42,75.74) v1(42.42,74.84) v1(42.42,74.02) v1(42.42,73.13) v1(42.42,72.23) v1(46.08,91.8) v1(46.08,5.44) v1(51.16,91.8) v1(51.16,5.44) v1(56.24,96.88) v1(56.24,91.8) v1(56.24,5.44) v1(61.32,96.88) v1(61.32,5.44) v1(66.4,96.88) v1(66.4,5.44) v1(71.48,96.88) v1(71.48,5.44) v1(74.04,92.13) v1(74.04,91.14) v1(74.04,90.14) v1(74.04,89.15) v1(74.04,88.16) v1(76.56,96.88) v1(76.56,91.8) v1(76.56,5.44) v1(81.64,96.88) v1(81.64,91.8) v1(81.64,5.44) v1(86.72,96.88) v1(86.72,91.8) v1(86.72,5.44) v1(91.8,96.88) v1(91.8,91.8) v1(91.8,5.44) v1(96.88,91.8) v1(96.88,5.44) v2(2.35,37.77) v2(3.49,37.77) v2(3.81,78.28) v2(5,84) v2(6.35,45.77) v2(7.49,45.77) v2(15.99,63.03) v2(29.33,62.91) v2(32.77,88.7) v2(32.77,87.36) v2(32.77,86.03) v2(32.77,84.7) v2(32.77,83.36) v2(51.31,81.97) v2(52.56,81.97) v2(53.81,81.97) v2(55.05,81.97) v2(56.3,81.97) v2(57.55,81.97) v2(58.8,81.97)
VCC+3.3V: length 197.3
  Top Layer w0.203: v1(62.45,50.14) 62.47,50.16 U4.11 ; U4.50 53.92,36.2 v4(53.58,35.86) ; v1(70.88,51.61) 69.34,51.61 69.09,51.36 69.09,49.94 U4.100 ; R7.2 84.2,60.5 83.31,61.39 83.31,64.31 U17.5 ; v4(71.26,36.25) 67.54,36.25 U4.75 ; U4.28 53.84,48.95 52.32,48.95 51.69,49.58 v2(50.91,49.58)
  Top Layer w0.381: U4.19 58.47,49.53 v1(58.55,49.45) ; R3.2 49.8,73.09 48.39,71.68 v2(48.39,71.04) ; v1(65.15,53.14) 64.97,52.95 U4.6
  POWER w0.203: v2(50.91,49.58) 50.91,50.99
  POWER w0.381: 54.48,20.62 53.21,21.9 53.21,27.86 53.97,28.63 53.97,35.47 v4(53.58,35.86) 53.58,49.58 53.58,49.58 ; v2(49.02,59.06) 49.02,52.88 51.77,50.14 v1(62.45,50.14) 68.12,50.14 69.6,51.61 v1(70.88,51.61) ; 53.58,49.58 54.99,49.58 57.15,47.42 57.15,41.71 60.58,38.28 67.06,38.28 69.09,36.25 v4(71.26,36.25) ; 53.58,49.58 v2(50.91,49.58)
  POWER w0.762: v3(36.81,48.18) 36.81,69.25 38.61,71.04 44.07,71.04 46.74,68.38 46.74,67.11 48.26,65.58 48.26,59.82 v2(49.02,59.06) ; v2(55.37,62.53) 56.26,61.65 66.68,61.65 67.56,60.76 67.56,58.09 67.94,57.71 v1(68.2,57.71)
  Bottom Layer w0.381: v1(65.15,53.14) 68.2,56.19 v1(68.2,57.71) ; v1(58.55,49.45) 59.06,49.96 59.06,53.01 57.78,54.28 56.39,54.28 55.5,55.17 v2(55.5,56.45)
  vias: v1(50.42,66.98) v1(51.34,66.98) v1(52.26,66.98) v1(53.18,66.98) v1(54.1,66.98) v2(48.39,69.84) v2(48.39,68.63) v2(53.97,70.16) v2(53.97,69.01) v2(55.37,61.39) v3(45.59,13.66) v3(51.31,13.64) v3(56.77,13.66) v3(62.48,13.58)
VCC+5V:
  vias: v1(87.25,86.28) v1(87.25,85.01) v1(87.25,83.74) v1(88.77,86.28) v1(88.77,85.01) v1(88.77,83.74) v2(84.46,85.52) v2(84.46,84.25) v2(84.71,82.98) v2(87.43,82.35) v2(87.43,81.08) v2(87.43,79.81) v2(89.03,82.35) v2(89.03,81.08) v2(89.03,79.81)
VCCA+3.3V: length 9.1
  Top Layer w0.203: U4.22 v1(56.97,52.63) ; v1(51.44,55.42) 51.45,55.44 C16.1
  Bottom Layer w0.203: v1(51.44,55.42) 51.44,55.04 52.2,54.28 54.23,54.28 55.88,52.63 v1(56.97,52.63)
VIN: length 13.3
  Top Layer w0.381: C2.1 39.24,93.4 ; R1.2 44.21,96.32 42.16,96.32 40.39,94.54 v1(40.39,86.79)
  vias: v1(24.81,98.6) v1(25.72,98.6) v1(41.61,86.76) v2(25.36,91.03) v2(38.35,90.73) v2(39.5,90.73)
1LOG+5V: length 41.8
  Bottom Layer w0.203: U10.9 20.88,79.63 19.81,79.63 19.76,79.68 17.02,79.68 16.02,78.68 16.02,77.5 14.22,75.71 14.22,72.95 12.13,70.86 U11.2
  Bottom Layer w0.254: U12.2 34.99,63.74 35.43,64.19 35.43,69.14 34.67,69.9 32.38,69.9 27.31,74.98 v1(23.11,74.98)
2LOG+5V: length 44.5
  Top Layer w0.203: v1(15.88,38.02) 21.46,38.02 22.22,37.26 U15.9
  Bottom Layer w0.203: U13.2 13.02,29.84 14.48,31.29 14.48,33.83 15.86,35.21 15.86,38.01 v1(15.88,38.02) ; v1(22.35,33.4) 31.19,33.4 31.22,33.43 31.34,33.43 31.95,32.82 31.95,30.66 33.25,29.37 34.64,29.37 35.31,28.7 35.31,24.49 U14.2
BOOT0: length 25.3
  Top Layer w0.203: U4.94 v1(67.31,46.87)
  Top Layer w0.254: v1(60.71,29.12) R8.2
  Bottom Layer w0.254: v1(67.31,46.87) 63.71,46.87 60.71,43.87 v1(60.71,29.12)
BOOT1: length 39.1
  Top Layer w0.203: v1(55.37,44.37) U4.37 45.32,44.37 44.4,45.29 44.4,47.71 42.64,49.46 40.78,49.46 U8.17
  Top Layer w0.254: v1(52.45,28.17) 52.38,28.1 R9.1
  Bottom Layer w0.254: v1(55.37,44.37) 55.37,30.15 53.34,28.12 52.51,28.12 v1(52.45,28.17)
DCDC_OUT:
  vias: v1(62.23,73.71) v1(63.12,73.71) v1(64.01,73.71) v1(64.64,73.2) v1(64.9,72.44) v1(64.9,71.68) v2(70.23,79.76) v2(75.95,83.11) v2(78.74,83.74) v2(80.39,82.6) v2(82.36,82.59)
ENA1: length 65.8
  Top Layer w0.203: U8.11 40.78,57.08 42.64,57.08 43.43,56.29 43.43,54.62 45.04,53.01 45.04,49.71 46.23,48.51 46.23,47.78 46.69,47.33 53.88,47.33 U4.31
  Bottom Layer w0.203: U10.6 18.54,81.33 19.94,79.93 22.99,79.93 23.62,79.3 23.62,77.65 24.82,76.45 33.86,76.45 38.16,72.15 38.16,56.5 38.37,56.3 39.26,56.3 U8.11
ENA2: length 62.9
  Top Layer w0.203: U8.37 41,24.29 44.48,24.29 48.3,28.1 48.3,30.09 50.42,32.21 57.43,32.21 59.47,34.25 U4.59
  Bottom Layer w0.203: 18.42,40.94 18.42,39.04 20.94,36.52 20.94,35.38 21.72,34.59 35.91,34.59 37.18,33.33 37.18,25.35 U8.37
ENB1: length 53
  Top Layer w0.203: U4.32 53.91,46.88 46.41,46.88 45.93,47.36 45.93,48.39 44.73,49.58 44.73,52.89 42.16,55.45 U8.12
  Bottom Layer w0.203: U8.12 40.89,57.2 40.89,58.97 40,59.86 38.75,59.86 38.47,60.13 38.47,72.27 33.99,76.76 26.29,76.76 U10.11
ENB2: length 56.6
  Top Layer w0.203: U4.60 59.97,33.98 57.89,31.9 50.55,31.9 48.6,29.96 48.6,27.19 44.32,22.91 U8.38
  Bottom Layer w0.203: U15.11 26.82,37.92 35.31,37.92 37.49,35.74 37.49,25.95 39.15,24.3 40.1,24.3 40.11,24.31 40.77,24.31 U8.38
ENC1: length 21.8
  Bottom Layer w0.203: U11.3 11.3,65.69 11.3,57.84 12.06,57.07 19.18,57.07 H4.3
ENC2: length 17
  Bottom Layer w0.203: H4.4 17.78,55.93 12.7,55.93 10.8,57.84 10.8,63.7 U11.4
ENC3: length 16
  Bottom Layer w0.203: H4.1 25.65,55.93 26.54,56.82 30.1,56.82 31.5,58.22 31.5,63.95 U12.3
ENC4: length 20.6
  Bottom Layer w0.203: H4.2 23.6,55.68 25.04,57.12 29.97,57.12 31.19,58.34 31.19,65.14 33.78,67.73 U12.4
ENC5: length 22.6
  Bottom Layer w0.203: H3.3 20.83,16.56 19.89,17.5 11.84,17.5 10.41,18.92 10.41,26.97 10.05,27.34 U13.3
ENC6: length 17.9
  Bottom Layer w0.203: H3.4 18.29,16.99 18.08,17.2 11.68,17.2 10.03,18.85 10.03,24.44 9.63,24.84 U13.4
ENC7: length 16
  Bottom Layer w0.203: H3.1 25.91,17.07 26.42,17.58 30.1,17.58 32.38,19.86 32.38,25.07 33.04,25.72 U14.3
ENC8: length 20.5
  Bottom Layer w0.203: U14.4 34.04,27.21 32.08,25.26 32.08,20.07 29.91,17.89 23.75,17.89 23.37,17.51 H3.2
FB: length 7.9
  Top Layer w0.381: 49.91,87.77 49.91,88.32 48.91,89.32 U1.4 ; 49.91,87.77 49.91,86.14 R20.1 ; 49.91,87.77 50.45,88.32 R21.2
IIC2_SCL: length 47.6
  Top Layer w0.203: U8.27 41.02,37.01 41.68,37.01 41.69,37 42.64,37 42.65,37.01 45.85,37.01 46.3,37.47 46.3,38.02 47.65,39.37 U4.47
  Bottom Layer w0.203: U8.27 40.89,34.34 43.56,34.34 43.94,33.96 43.94,13.42 40.48,9.96 H2.3
IIC2_SDA: length 42.8
  Top Layer w0.203: U8.28 42.23,35.55 45.78,35.55 46.61,36.37 46.61,37.9 47.67,38.96 53.82,38.96 U4.48
  Bottom Layer w0.203: U8.28 44.07,35.61 44.45,35.23 44.45,13 42.04,10.59 H2.4
IN1: length 63.4
  Top Layer w0.203: U8.15 40.83,52.06 43.12,52.06 43.81,51.36 43.81,49.15 45.01,47.96 45.01,45.61 45.25,45.37 U4.35
  Bottom Layer w0.203: U10.5 18.63,76.8 20.74,76.8 21.72,75.82 28.62,75.82 32.06,72.38 34.3,72.38 35.94,70.74 35.94,70.06 36.83,69.16 36.83,53.85 39.62,51.05 U8.15
IN2: length 58.9
  Top Layer w0.203: U8.16 42.16,50.37 44.7,47.83 44.7,45.48 45.32,44.87 U4.36
  Bottom Layer w0.203: U8.16 40.78,52.24 38.87,52.24 37.21,53.9 37.21,69.22 36.24,70.18 36.24,70.87 34.43,72.68 32.31,72.68 28.87,76.12 21.84,76.12 U10.7
IN3: length 61.9
  Top Layer w0.203: U8.1 40.78,69.78 43.04,69.78 43.93,68.9 43.93,65.17 45.25,63.84 45.25,60.76 46.66,59.35 46.66,55.9 48.36,54.21 58.62,54.21 60.47,52.36 U4.15
  Bottom Layer w0.203: U10.10 27.1,79.76 35.88,79.76 39.62,76.01 U8.1
IN4: length 55.7
  Top Layer w0.203: U4.16 59.97,52.43 58.49,53.9 48.23,53.9 46.36,55.78 46.36,59.17 44.95,60.58 44.95,63.69 43.62,65.02 43.62,66.7 42.16,68.15 U8.2
  Bottom Layer w0.203: U8.2 42.16,70.54 39.93,72.77 39.93,76.14 36.01,80.06 29.34,80.06 U10.12
IN5: length 66
  Top Layer w0.203: U8.39 40.89,21.64 46.99,21.64 48.91,23.56 48.91,29.83 50.67,31.6 58.04,31.6 60.47,34.03 U4.61
  Bottom Layer w0.203: U15.5 19.03,33.98 31.34,33.98 32.26,33.07 32.26,30.78 33.37,29.67 35.91,29.67 36.57,29.01 36.57,25.1 37.67,24 37.67,22.8 39.62,20.85 U8.39
IN6: length 64.9
  Top Layer w0.203: U4.62 60.97,34.09 58.17,31.29 50.8,31.29 49.28,29.77 49.28,22.99 46.66,20.37 U8.40
  Bottom Layer w0.203: U15.7 21.26,34.29 35.69,34.29 36.88,33.1 36.88,25.22 37.97,24.13 37.97,22.93 39.15,21.76 40.78,21.76 U8.40
IN7: length 53.2
  Top Layer w0.203: U8.35 40.88,26.7 44.05,26.7 50.17,32.82 56.64,32.82 58.47,34.64 U4.57
  Bottom Layer w0.203: 23.5,40.94 23.5,38.66 23.93,38.23 35.43,38.23 37.79,35.87 37.79,27.76 39.62,25.93 U8.35
IN8: length 51.9
  Top Layer w0.203: U8.36 45.21,25.45 47.99,28.23 47.99,30.21 50.29,32.51 57.1,32.51 58.97,34.38 U4.58
  Bottom Layer w0.203: U8.36 40.78,26.84 39.15,26.84 38.1,27.88 38.1,35.99 35.56,38.53 26.67,38.53 26.16,39.04 26.16,40.82 26.03,40.94
MVIN: length 6.9
  Top Layer w0.381: 5.34,41.57 5.46,41.69 5.46,45.14 4.97,45.63 R13.1
  vias: v1(19.81,98.6) v1(19.81,92.38) v1(20.72,98.6) v1(20.72,92.38) v1(22.31,98.6) v1(22.31,92.38) v1(23.22,98.6) v1(23.22,92.38) v2(5.45,41.58) v2(8.76,44.25) v2(10.54,86.79) v2(10.54,85.39) v2(10.54,84) v2(11.3,89.08) v2(12.7,88.44) v2(13.07,63.16) v2(16.76,68) v2(16.76,66.85) v2(16.76,65.71) v2(17.14,25.32) v2(17.14,23.93) v2(24.26,20.29) v2(24.26,18.72) v2(26.29,62.8) v2(36.57,80.58) v2(36.59,40.93)
NRST: length 35.4
  Top Layer w0.203: U4.14 v1(60.97,48.82)
  Top Layer w0.254: v1(84.2,53.26) R7.1 86.52,54.42 C27.1 86.63,56.65 RESET.1
  Bottom Layer w0.203: v1(60.97,48.82) 77.22,48.82 78.48,50.08 82.14,50.08 82.15,50.09 82.8,50.09 84.2,51.49 v1(84.2,53.26)
OSCH1: length 10.4
  Top Layer w0.203: C25.1 64.59,58.31 X1.1 62.44,58.43 61.85,58.43 61.47,58.05 61.47,53.64 61.93,53.19 61.93,51.46 U4.12
OSCH2: length 7.9
  Top Layer w0.203: U4.13 61.47,53.05 60.37,54.15 X1.3 60.22,56.45 C26.2
PA0: length 27.3
  Top Layer w0.203: U8.5 40.89,64.82 42.53,64.82 44.03,63.31 44.03,60.11 45.44,58.7 45.44,55.39 47.84,52.99 55.78,52.99 56.47,52.3 U4.23
PA1: length 22.5
  Top Layer w0.203: 42.38,63.77 43.73,62.42 43.73,59.98 45.14,58.57 45.14,55.26 47.72,52.68 55.45,52.68 55.97,52.16 U4.24
PA2: length 24.4
  Top Layer w0.203: U8.7 40.89,62.28 42.91,62.28 43.42,61.77 43.42,59.86 44.83,58.44 44.83,55.04 47.5,52.38 55.25,52.38 55.47,52.15 U4.25
PA3: length 19.7
  Top Layer w0.203: U4.26 52.98,49.87 51.96,50.88 46.55,50.88 45.95,51.49 45.95,53.43 44.35,55.03 44.35,58.5 42.16,60.68 U8.8
PA4: length 23.5
  Top Layer w0.203: U8.9 40.78,59.62 42.79,59.62 44.04,58.37 44.04,54.87 45.65,53.27 45.65,49.96 47.31,48.3 53.85,48.3 U4.29
PA5: length 19.3
  Top Layer w0.203: U4.30 47.31,47.87 45.34,49.83 45.34,53.14 43.74,54.74 43.74,56.42 42.16,57.99 U8.10
PA8: length 25
  Top Layer w0.203: U4.67 63.56,36.22 63.56,34.77 65.77,32.56 75.97,32.56 76.61,31.93 76.61,29.06 78.45,27.22 79.6,27.22 79.61,27.23 80.52,27.23 U7.34
PA9: length 21
  Top Layer w0.203: U4.68 63.97,34.8 65.88,32.89 76.07,32.89 76.91,32.06 76.91,29.19 77.72,28.37 U7.33
PA10: length 22.4
  Top Layer w0.203: U4.69 64.56,36.22 64.56,34.64 66,33.2 76.2,33.2 77.22,32.18 77.22,30.53 78.17,29.58 80.33,29.58 U7.32
PA11: length 17.4
  Top Layer w0.203: U7.31 76.45,33.58 66.05,33.58 65.06,34.57 65.06,36.22 U4.70
PA12: length 19.3
  Top Layer w0.203: U7.30 81.53,33.45 80.39,32.31 79.61,32.31 79.6,32.3 78.24,32.3 76.58,33.96 66.1,33.96 65.47,34.59 U4.71
PA13: length 26.4
  Top Layer w0.203: U4.72 v1(65.97,37.52)
  Bottom Layer w0.203: v1(65.97,37.52) 67.7,37.52 68.71,36.5 68.71,26.33 71.5,23.55 71.5,15.8 H1.1
PA14: length 26.5
  Top Layer w0.203: U4.76 v1(69.02,37.39)
  Bottom Layer w0.203: H1.3 76.33,15.8 76.33,21.64 72.77,25.2 70.61,25.2 69.02,26.79 v1(69.02,37.39)
PA15: length 12.1
  Top Layer w0.203: U4.77 74.21,38.37 U7.29
PB3: length 11.9
  Top Layer w0.203: U7.17 76.22,48.69 71.9,44.37 U4.89
PB4: length 15.3
  Top Layer w0.203: U7.16 81.41,51.23 80.14,49.96 77.06,49.96 71.97,44.87 U4.90
PB5: length 13.1
  Top Layer w0.203: U7.15 77.01,51.23 76,50.22 76,49.33 72.03,45.37 U4.91
PB6: length 17.3
  Top Layer w0.203: U7.14 80.39,52.5 76.33,52.5 75.69,51.87 75.69,49.46 72.1,45.87 U4.92
PB7: length 15.2
  Top Layer w0.203: U7.13 78.99,53.64 75.95,53.64 75.39,53.09 75.39,49.58 72.17,46.37 U4.93
PB8: length 19
  Top Layer w0.203: U7.12 80.39,55.04 75.82,55.04 75.08,54.31 75.08,49.71 72.74,47.37 U4.95
PB9: length 17.1
  Top Layer w0.203: U7.11 78.99,56.44 75.56,56.44 74.78,55.65 74.78,49.84 72.81,47.87 U4.96
PB12: length 61.8
  Top Layer w0.203: C28.1 47.15,11.54 KEY1.1 48.51,15.8 48.39,15.93 45.86,15.93 R11.1 v1(45.59,17.07) ; v1(56.13,39.67) 55.47,39.01 U4.51 55.47,35.14 54.98,34.65 46.89,34.65 46.47,34.22 40.78,34.22 U8.29
  Bottom Layer w0.203: v1(45.59,17.07) 49.73,17.07 53.03,20.37 53.03,26.25 55.7,28.92 55.7,38.66 56.13,39.09 v1(56.13,39.67)
PB13: length 54.9
  Top Layer w0.203: v1(57.21,39.74) 55.97,38.49 U4.52 55.97,35.17 55.14,34.34 47.02,34.34 45.75,33.07 U8.30 ; C44.1 52.86,11.54 54.1,12.78 54.1,15.04 53.48,15.66 R17.1 v1(51.31,16.94)
  Bottom Layer w0.203: v1(57.21,39.74) 56.01,38.53 56.01,28.75 54.06,26.81 54.03,26.81 53.34,26.12 53.34,18.97 v1(51.31,16.94)
PB14: length 60
  Top Layer w0.203: C45.1 63.97,11.59 KEY3.1 65.41,14.77 64.52,15.66 R18.1 v1(62.48,17.2) ; U8.31 40.87,31.78 44.88,31.78 47.15,34.04 55.27,34.04 56.47,35.24 U4.53 56.47,38.48 57.02,39.04 58.42,39.04 v1(59.18,38.28)
  Bottom Layer w0.203: v1(59.18,38.28) 58.47,37.57 58.47,18.29 59.44,17.32 62.36,17.32 v1(62.48,17.2)
PB15: length 52.9
  Top Layer w0.203: C46.1 56.84,11.61 58.52,11.61 59.69,12.78 59.69,15.04 59.07,15.66 R19.1 v1(56.77,16.81) ; U8.32 44.07,30.53 47.27,33.73 55.5,33.73 56.97,35.2 U4.54 56.97,37.97 57.28,38.28 v1(58.17,38.28)
  Bottom Layer w0.203: v1(56.77,16.81) 58.17,18.21 v1(58.17,38.28)
PC2: length 32.3
  Top Layer w0.203: U4.17 59.47,52.5 58.37,53.6 48.11,53.6 46.05,55.65 46.05,59.04 44.64,60.45 44.64,63.57 43.32,64.89 43.32,66.57 42.64,67.24 40.78,67.24 U8.3
PC3: length 27.6
  Top Layer w0.203: U4.18 58.97,52.56 58.24,53.29 47.98,53.29 45.75,55.52 45.75,58.91 44.34,60.32 44.34,63.44 42.16,65.61 U8.4
PC4: length 20.8
  Top Layer w0.203: U4.33 46.4,46.37 45.62,47.14 45.62,48.21 44.43,49.41 44.43,52.76 42.64,54.54 40.78,54.54 U8.13
PC5: length 17.5
  Top Layer w0.203: U8.14 42.54,53.39 44.12,51.82 44.12,49.28 45.31,48.09 45.31,46.18 45.62,45.87 U4.34
PC6: length 30.6
  Top Layer w0.203: U4.63 61.47,35.14 65.33,31.28 74.93,31.28 75.28,30.92 75.28,25.1 78.23,22.15 78.63,22.15 78.64,22.14 79.6,22.14 79.61,22.15 80.52,22.15 U7.38
PC7: length 25.8
  Top Layer w0.203: U7.37 79.12,23.55 76.2,26.47 76.2,26.49 75.59,27.1 75.59,31.17 75.17,31.58 65.46,31.58 61.97,35.07 U4.64
PC8: length 27.7
  Top Layer w0.203: U4.65 62.47,35.01 65.58,31.89 75.43,31.89 75.9,31.42 75.9,27.23 78.45,24.68 80.51,24.68 U7.36
PC9: length 24
  Top Layer w0.203: U7.35 77.72,25.83 76.2,27.36 76.2,31.9 75.91,32.19 65.71,32.19 62.97,34.94 U4.66
PC10: length 14.8
  Top Layer w0.203: U4.78 74.22,38.87 78.24,34.84 79.6,34.84 79.61,34.85 80.52,34.85 U7.28
PC11: length 11.5
  Top Layer w0.203: U7.27 77.98,35.99 74.6,39.37 U4.79
PC12: length 14.2
  Top Layer w0.203: U7.26 80.39,37.26 78.1,37.26 75.5,39.87 U4.80
PC13: length 27
  Top Layer w0.203: U7.3 72.77,66.47 71.41,65.11 71.41,56.63 68.71,53.92 65.05,53.92 64.47,53.34 U4.7
PC14: length 31.7
  Top Layer w0.203: U4.8 63.97,53.34 64.86,54.23 68.58,54.23 71.11,56.76 71.11,66.33 72.62,67.84 80.49,67.84 U7.2
PC15: length 29.7
  Top Layer w0.203: U7.1 73.36,69.01 70.8,66.46 70.8,56.88 68.45,54.53 64.64,54.53 63.47,53.36 U4.9
PD0: length 10.9
  Top Layer w0.203: U7.25 77.34,38.53 75.51,40.37 U4.81
PD1: length 13.5
  Top Layer w0.203: U4.82 77.5,40.87 77.6,40.77 77.65,40.77 78.5,39.92 80.51,39.92 U7.24
PD2: length 10.2
  Top Layer w0.203: U7.23 77.72,41.07 77.43,41.37 U4.83
PD3: length 13.4
  Top Layer w0.203: U7.22 80.39,42.34 72.03,42.34 71.56,41.87 U4.84
PD4: length 10.6
  Top Layer w0.203: U7.21 72.87,43.61 71.63,42.37 U4.85
PD5: length 14.1
  Top Layer w0.203: U4.86 71.69,42.87 73.71,44.88 80.52,44.88 81.66,46.03 U7.20
PD6: length 11.3
  Top Layer w0.203: U4.87 71.76,43.37 74.55,46.15 U7.19
PD7: length 14.6
  Top Layer w0.203: U4.88 71.83,43.87 75.5,47.54 80.51,47.54 U7.18
PD8: length 21.9
  Top Layer w0.203: U4.55 57.47,35.27 55.63,33.43 47.73,33.43 43.44,29.14 40.78,29.14 U8.33
PD9: length 20
  Top Layer w0.203: U8.34 44.32,27.99 49.46,33.12 56.13,33.12 57.97,34.96 U4.56
PE0: length 20.9
  Top Layer w0.203: U7.10 80.44,57.63 75.41,57.63 74.47,56.69 74.47,49.96 72.88,48.37 U4.97
PE1: length 18.6
  Top Layer w0.203: U4.98 72.94,48.87 74.17,50.09 74.17,57.45 75.56,58.85 U7.9
PE2: length 20.1
  Top Layer w0.203: U4.1 68.36,51.42 72.95,56.01 72.95,58.98 74,60.03 80.3,60.03 U7.8
PE3: length 19.2
  Top Layer w0.203: U7.7 79.06,61.46 74.23,61.46 72.64,59.87 72.64,58.29 72.63,58.28 72.63,56.12 69.21,52.7 67.06,52.7 66.97,52.62 U4.2
PE4: length 24.1
  Top Layer w0.203: U7.6 80.27,62.55 73.42,62.55 72.33,61.46 72.33,56.25 69.09,53.01 66.93,53.01 66.47,52.55 U4.3
PE5: length 22.6
  Top Layer w0.203: U4.4 65.97,52.51 66.78,53.31 68.96,53.31 72.02,56.38 72.02,62.55 73.41,63.93 U7.5
PE6: length 27.5
  Top Layer w0.203: U7.4 80.39,65.2 72.77,65.2 71.72,64.15 71.72,56.5 68.83,53.62 66.65,53.62 65.47,52.44 U4.5
PE7: length 14.3
  Top Layer w0.203: U4.38 45.39,43.87 44.09,45.16 44.09,46.38 U8.18
PE8: length 17
  Top Layer w0.203: U8.19 40.89,47.04 42.93,47.04 43.56,46.41 43.56,45.26 45.46,43.37 U4.39
PE9: length 13.7
  Top Layer w0.203: U4.40 44.57,42.87 44.37,43.07 44.37,43.87 43.55,44.69 42.75,44.69 42.16,45.28 U8.20
PE10: length 21.2
  Top Layer w0.203: 36.87,45.91 36.87,43.83 37.47,43.23 U8.21 40.78,44.38 43.42,44.38 44.07,43.74 44.07,42.85 44.55,42.37 U4.41
PE11: length 12.3
  Top Layer w0.203: U8.22 43.53,41.87 U4.42
PE12: length 15
  Top Layer w0.203: U4.43 43.27,41.37 42.79,41.84 40.78,41.84 U8.23
PE13: length 11.8
  Top Layer w0.203: U4.44 42.34,40.87 U8.24
PE14: length 15.2
  Top Layer w0.203: U4.45 53.82,40.27 47.69,40.27 46.72,39.3 40.78,39.3 U8.25
PE15: length 12.5
  Top Layer w0.203: U4.46 47.72,39.87 46,38.15 U8.26
VCAP_1: length 3.5
  Top Layer w0.203: U4.49 52.67,38.37 52.07,37.77 C35.2
VCAP_2: length 7
  Top Layer w0.203: v1(66.47,30.66) 66.47,29.45 C34.2 ; U4.73 v1(66.47,34.85)
  Bottom Layer w0.203: v1(66.47,34.85) v1(66.47,30.66)
VOUT: length 8.5
  Top Layer w0.381: CN2.2 53.89,86.96 52.96,86.03 R20.2
  vias: v2(48.9,82.47) v2(48.9,81.33) v2(48.9,80.19) v2(51.69,78.16) v2(54.48,77.14) v2(58.04,77.27) v2(64.77,92.13) v2(64.77,90.86) v2(64.77,89.71) v2(64.77,88.44)
$1N3: length 2.1
  Top Layer w0.381: LED1.2 48.35,96.57 R1.1
$1N7: length 6.2
  Top Layer w0.381: U1.1 48.02,85.51 48.77,84.76 51.67,84.76 C1.1
$1N8: length 9.8
  Top Layer w0.381: C1.2 45.34,83.62 43.45,85.51 U1.8
$1N30: length 2.1
  Top Layer w0.254: LED3.2 53.77,74.55 R3.1
$1N49:
  vias: v2(66.47,86.7) v2(70.23,82.65)
$2N98: length 9.6
  Top Layer w0.203: v1(57.73,52.65) 57.73,52.4 57.56,52.23 57.56,51.51 U4.21
  Bottom Layer w0.203: v1(57.73,52.65) 57.53,52.86 57.53,52.86 57.2,53.19 57.19,53.19 57.16,53.22 55.72,53.22 53.47,55.47 v1(53.47,58.34)
$2N110: length 6.2
  Top Layer w0.203: U6.3 59.69,23.16 60.71,24.18 60.71,26.23
$2N112: length 5.9
  Top Layer w0.203: R9.2 51.18,23.67 51.69,23.16 54.48,23.16
$2N122: length 2.3
  Top Layer w0.381: R10.1 34.81,46.06 34.67,45.91
$3N201: length 2.2
  Top Layer w0.381: LED5.1 6.83,86.81 R12.2
$3N203: length 2.1
  Top Layer w0.381: R13.2 2.53,43.51 LED8.2
$3N205: length 2.1
  Top Layer w0.381: LED6.2 26.26,66.85 R14.1
$3N206: length 2.2
  Top Layer w0.381: R22.1 25.34,24.79 LED7.2

## Copper pours and planes (outline as drawn; the poured copper is in the pictures)
AGND on Top Layer: 45.73,62.92 45.87,63.07 47.98,63.07 48.26,62.79 48.26,60.5 48.13,60.38 45.97,60.38 45.72,60.63 45.72,62.66
AGND on Top Layer: 52.61,61.41 54.33,61.41 54.61,61.12 54.61,60.88 54.86,60.63 56.13,60.63 56.77,61.27 56.77,65.33 57.4,65.96 60.08,65.96 60.45,65.59 60.45,60.5 59.58,59.63 52.86,59.63 52.61,59.89
AGND on Top Layer: 52.72,57.52 54.54,57.52 54.61,57.45 54.61,55.55 54.48,55.42 52.7,55.42 52.45,55.67 52.45,57.26
AGND on Top Layer: 45.97,74.47 48.01,74.47 48.39,74.09 48.39,72.45 47.37,71.43 47.37,63.63 49.23,61.77 54.52,61.77 54.52,60.84 54.86,60.5 56.01,60.5 56.64,61.14 56.64,64.95 57.53,65.84 59.56,65.84 60.2,65.2 60.2,61.9 58.67,60.38 57.36,60.38 56.36,59.37 56.36,56.24 55.29,55.17 47.33,55.17 45.47,57.04 45.47,73.97
AGND on Top Layer: 48.39,74.4 48.47,74.32 48.47,72.39 48.26,72.19 45.48,72.19 45.34,72.33 45.34,74.3 45.49,74.4
AGND on Bottom Layer: 45.97,74.47 48.01,74.47 48.39,74.09 48.39,72.45 47.37,71.43 47.37,63.63 49.23,61.77 54.52,61.77 54.52,60.84 54.86,60.5 56.01,60.5 56.64,61.14 56.64,64.95 57.53,65.84 59.56,65.84 60.2,65.2 60.2,61.9 58.67,60.38 57.36,60.38 56.36,59.37 56.36,56.24 55.29,55.17 47.33,55.17 45.47,57.04 45.47,73.97
AGND on GND: 45.97,74.47 48.01,74.47 48.39,74.09 48.39,72.45 47.37,71.43 47.37,63.63 49.23,61.77 54.52,61.77 54.52,60.84 54.86,60.5 56.01,60.5 56.64,61.14 56.64,64.95 57.53,65.84 59.56,65.84 60.2,65.2 60.2,61.9 58.67,60.38 57.36,60.38 56.36,59.37 56.36,56.24 55.29,55.17 47.33,55.17 45.47,57.04 45.47,73.97
DGND on Top Layer: 49.39,38.67 49.66,38.41 49.66,36.8 49.88,36.58 52.25,36.58 52.45,36.37 52.45,35.36 52.07,34.98 47.62,34.98 47.37,35.23 47.37,38.45 47.59,38.67
DGND on Top Layer: 65.15,28.37 67.82,28.37 68.2,27.99 68.2,25.96 67.82,25.58 65.28,25.58 64.77,26.09 64.77,27.99
DGND on Top Layer: 70.37,49.6 70.61,49.83 71.75,49.83 71.88,49.96 71.88,53.01 72.26,53.39 73.53,53.39 73.91,53.01 73.91,50.09 73.79,49.96 73.15,49.96 72.9,49.71 72.9,49.45 72.52,49.07 70.38,49.05
DGND on Top Layer: 44.15,9.96 44.78,10.59 66.69,10.59 68.09,11.99 71.25,11.99 72.52,13.26 72.52,16.54 72.91,16.94 74.68,16.94 75.06,16.56 75.06,12.5 75.44,12.12 76.96,12.12 77.6,11.48 77.6,8.56 76.58,7.54 44.7,7.54 44.2,8.05 44.2,9.96
DGND on Top Layer: 74.37,87.37 75.69,88.7 75.69,89.08 76.04,89.43 81.82,89.43 82.17,89.08 82.17,88.32 82.55,87.94 83.56,87.94 83.82,87.67 83.82,86.67 83.57,86.41 81.41,86.41 80.9,85.9 80.9,84.89 80.77,84.76 74.68,84.76 74.37,85.14
DGND on Top Layer: 72.26,37.98 72.36,38.08 73.86,38.08 74.04,37.9 74.04,37.26 74.17,37.14 75.06,37.14 75.31,36.88 75.31,34.59 75.06,34.34 72.64,34.34 72.26,34.72
DGND on Top Layer: 49.54,64.2 54.21,64.2 54.36,64.06 54.36,62.61 54.09,62.35 50.56,62.35 50.56,63.23 50.37,63.42 49.4,63.42 49.28,63.55 49.28,63.93
DGND on Top Layer: 93.38,87.17 93.66,86.9 93.66,85.34 93.98,85.01 98.55,85.01 99.06,84.51 99.06,79.05 98.68,78.66 92.25,78.66 91.88,79.03 91.88,87.17
DGND on Top Layer: 87.74,55.44 88.74,55.44 88.74,55.64 89.15,56.06 89.15,58.6 89.92,59.36 91.57,59.36 92.07,58.85 92.07,53.52 91.31,52.76 87.88,52.76 87.5,53.14 87.5,55.21
DGND on Top Layer: 46.16,76.95 47.52,76.95 47.75,76.72 47.75,75.49 47.88,75.36 48.77,75.36 48.9,75.23 48.9,74.73 48.77,74.6 46.1,74.6 45.85,74.85 45.85,76.63
DGND on Top Layer: 55.04,66.4 56.33,66.4 56.51,66.22 56.51,63.42 56.26,63.17 54.86,63.17 54.74,63.3 54.74,66.1
DGND on Top Layer: 68.31,61 68.83,61.52 70.36,61.52 70.61,61.27 70.61,59.1 70.36,58.85 68.56,58.85 68.33,59.08 68.33,59.23 68.31,59.25
DGND on Top Layer: 54.6,59.27 54.87,59.54 57.1,59.54 57.28,59.36 57.28,57.71 57.15,57.58 54.74,57.58 54.61,57.71 54.61,59.27
DGND on Top Layer: 46.99,50.34 47.37,50.72 49.68,50.72 49.91,50.48 49.91,48.69 49.78,48.56 47.37,48.56 46.99,48.95
DGND on Top Layer: outline of 90 points within 5.22,8.55 99.31,89.08
DGND on Top Layer: 54.86,68.12 55.35,68.61 58.27,68.61 58.55,68.89 58.55,70.46 58.79,70.7 65.07,70.7 65.23,70.54 65.23,67.31 65.02,67.11 55.12,67.11 54.86,67.36
DGND on Bottom Layer: outline of 90 points within 5.22,8.55 99.31,89.08
DGND on GND: outline of 90 points within 5.22,8.55 99.31,89.08
PGND on Top Layer: 1.76,37.13 1.76,37.14 1.14,37.14 0.89,37.39 0.89,39.8 1.27,40.18 6.35,40.18 6.35,40.07 6.73,39.69 6.73,37.9 6.42,37.59 4.27,37.59 3.81,37.13
PGND on Top Layer: 4.44,85.14 7.47,85.14 7.47,83.11 4.44,83.11
PGND on Top Layer: 0,100 99.95,100 99.95,98.48 100,98.42 100,89.54 75.24,89.54 73.91,88.22 73.91,86.03 72.64,84.76 65.41,84.76 64.26,83.62 64.26,80.31 62.99,79.05 50.8,79.05 50.42,78.66 50.42,78.03 49.78,77.39 45.85,77.39 45.21,76.76 45.21,71.84 44.67,71.3 42.54,71.3 41.91,71.93 41.91,74.35 40.64,75.62 32.38,75.62 30.73,73.97 30.73,59.36 29.34,57.96 12.7,57.96 12.06,58.6 12.06,74.22 10.54,75.74 6.98,75.74 4.95,73.71 4.95,57.58 8,54.53 8,54.43 11.2,51.23 25.27,51.23 31.37,45.14 35.18,45.14 38.35,41.96 38.35,36.75 37.72,36.12 34.58,36.12 31.8,33.34 31.8,18.4 30.44,17.04 14.44,17.04 12.95,18.53 12.95,32.44 10.71,35.21 8.24,35.21 6.35,33.55 6.35,9.19 7.24,8.31 98.55,8.31 100.2,6.66 100.2,0.18 99.82,-0.2 0,-0.2
PGND on Top Layer: 14.69,19.64 14.91,19.86 18.03,19.86 18.29,19.61 18.29,17.2 17.96,16.87 15.06,16.87 14.69,17.24
PGND on Top Layer: 22.58,25.64 23.81,25.64 24.27,25.18 24.27,23.53 24.64,23.16 26.92,23.16 27.05,23.04 27.05,21.03 22.84,21.03 22.48,21.39 22.48,25.54
PGND on Top Layer: 51.18,82.6 59.54,82.6 60.32,81.82 60.32,79.43 60.07,79.17 50.77,79.17 50.51,79.42 50.51,81.93
PGND on Top Layer: 24.45,76.45 25.64,76.45 25.91,76.19 25.91,73.84 26.03,73.71 26.8,73.71 27.18,73.33 27.18,70.08 28.45,68.81 28.45,68.38 29.19,67.63 29.19,66.08 28.83,65.71 27.75,65.71 27.18,66.28 27.18,68.16 26.71,68.63 24.77,68.63 24.51,68.89 24.51,73.75 24.19,74.08 24.19,76.19
PGND on Top Layer: 24.78,34.1 26.3,34.1 27.17,33.24 27.17,32.06 27.43,31.8 27.43,28.7 27.3,28.57 24.82,28.57 24.64,28.75 24.64,33.95
PGND on Top Layer: 1.52,87.78 3.31,87.78 3.31,84.89 1.52,84.89
PGND on Top Layer: 3.04,79.54 6.45,79.54 6.45,77.38 3.04,77.38
PGND on Top Layer: 36.96,84.35 36.96,81.97 32.51,81.97 32.03,82.45 32.03,90.08 32.43,90.47 37.63,90.44 38.1,89.97 38.1,85.12 37.83,84.85 37.45,84.85
PGND on Top Layer: 40.77,88.44 40.89,88.57 45.72,88.57 45.97,88.32 45.97,86.28 45.85,86.16 43.43,86.16 43.31,86.28 43.31,87.55 43.18,87.68 40.89,87.68 40.77,87.81
PGND on Top Layer: 71.24,92.67 74.39,92.67 74.55,92.51 74.55,87.81 73.91,87.17 73.91,86.16 73.66,85.9 71.37,85.9 70.99,86.28 70.99,92.42
PGND on Top Layer: 36.16,39.64 36.12,39.67 37.85,39.67 38.1,39.42 38.1,37.01 37.97,36.88 35.81,36.88 35.6,37.09 35.6,39.21 36.03,39.64
PGND on Top Layer: 6.09,46.49 6.14,46.53 8,46.53 8.24,46.3 8.24,45.22 8,45.12 7.87,45.07 7.87,43.3 7.68,43.1 6.1,43.1 5.79,43.41 5.79,46.32 6,46.53 6.1,46.53 6.09,46.53
PGND on Top Layer: 41.53,76.38 42.29,77.14 44.58,77.14 44.96,76.76 44.96,72.06 44.2,71.3 42.29,71.3 41.53,72.06
PGND on Top Layer: 34.44,78.84 34.68,79.08 37.68,79.08 38.1,78.66 38.1,76.25 37.72,75.87 34.44,75.87 34.28,76.03 34.28,78.65 34.44,78.84
PGND on Bottom Layer: 0,100 99.95,100 99.95,98.48 100,98.42 100,89.54 75.24,89.54 73.91,88.22 73.91,86.03 72.64,84.76 65.41,84.76 64.26,83.62 64.26,80.31 62.99,79.05 50.8,79.05 50.42,78.66 50.42,78.03 49.78,77.39 45.85,77.39 45.21,76.76 45.21,71.84 44.67,71.3 42.54,71.3 41.91,71.93 41.91,74.35 40.64,75.62 32.38,75.62 30.73,73.97 30.73,59.36 29.34,57.96 12.7,57.96 12.06,58.6 12.06,74.22 10.54,75.74 6.98,75.74 4.95,73.71 4.95,57.58 8,54.53 8,54.43 11.2,51.23 25.27,51.23 31.37,45.14 35.18,45.14 38.35,41.96 38.35,36.75 37.72,36.12 34.58,36.12 31.8,33.34 31.8,18.4 30.44,17.04 14.44,17.04 12.95,18.53 12.95,32.44 9.92,35.47 6.74,35.47 5.84,34.57 5.84,9.7 8.13,7.42 99.44,7.42 100.2,6.66 100.2,0.18 99.82,-0.2 0,-0.2
PGND on GND: 0,100 99.95,100 99.95,98.48 100,98.42 100,89.54 75.24,89.54 73.91,88.22 73.91,86.03 72.64,84.76 65.41,84.76 64.26,83.62 64.26,80.31 62.99,79.05 50.8,79.05 50.42,78.66 50.42,78.03 49.78,77.39 45.85,77.39 45.21,76.76 45.21,71.84 44.67,71.3 42.54,71.3 41.91,71.93 41.91,74.35 40.64,75.62 32.38,75.62 30.73,73.97 30.73,59.36 29.34,57.96 12.7,57.96 12.06,58.6 12.06,74.22 10.54,75.74 6.98,75.74 4.95,73.71 4.95,57.58 8,54.53 8,54.43 11.2,51.23 25.27,51.23 31.37,45.14 35.18,45.14 38.35,41.96 38.35,36.75 37.72,36.12 34.58,36.12 31.8,33.34 31.8,18.4 30.44,17.04 14.44,17.04 12.95,18.53 12.95,32.44 9.92,35.47 6.74,35.47 5.84,34.57 5.84,9.7 8.13,7.42 99.44,7.42 100.2,6.66 100.2,0.18 99.82,-0.2 0,-0.2
VCC+3.3V on Top Layer: 50.16,67.74 54.36,67.74 54.71,67.39 54.71,64.57 54.46,64.31 49.93,64.31 49.63,64.61 49.68,67.25
VCC+3.3V on Top Layer: 47.88,72.19 53.34,72.19 54.61,70.92 57.66,70.92 58.13,70.44 58.13,69.61 57.53,69.01 55.12,69.01 53.97,67.87 47.58,67.87 47.2,68.25 47.2,71.51
VCC+3.3V on Top Layer: 70.49,58.6 70.49,56.95 70.23,56.69 67.44,56.69 67.31,56.82 67.31,58.72 67.56,58.97 70.11,58.97
VCC+3.3V on POWER: 57.78,70.54 57.78,69.39 57.15,68.76 55.25,68.76 54.73,68.24 54.73,63.94 56.2,62.47 56.2,55.17 55.81,54.78 48.27,54.78 47.24,55.8 47.24,59.23 46.6,59.88 46.6,62.52 46.86,62.79 48.51,62.79 49.78,64.06 49.78,66.85 49.4,67.23 47.88,67.23 47.24,67.87 47.24,71.55 47.92,72.22 52.03,72.22 53.34,70.92 57.4,70.92
VCC+3.3V on POWER: 44.68,14.33 45,14.66 51.76,14.66 53.34,16.24 53.34,21.73 53.76,22.15 58.02,22.15 58.47,21.7 58.47,19.18 59.56,18.09 64.01,18.09 65.02,17.07 65.02,15.8 66.8,14.02 76.89,14.02 77.27,14.4 77.27,16.13 78.08,16.94 79.88,16.94 80.26,16.56 80.26,12.88 79.12,11.74 45.32,11.74 44.68,12.38
